# Altium project Acquisition_Board.PrjPcb
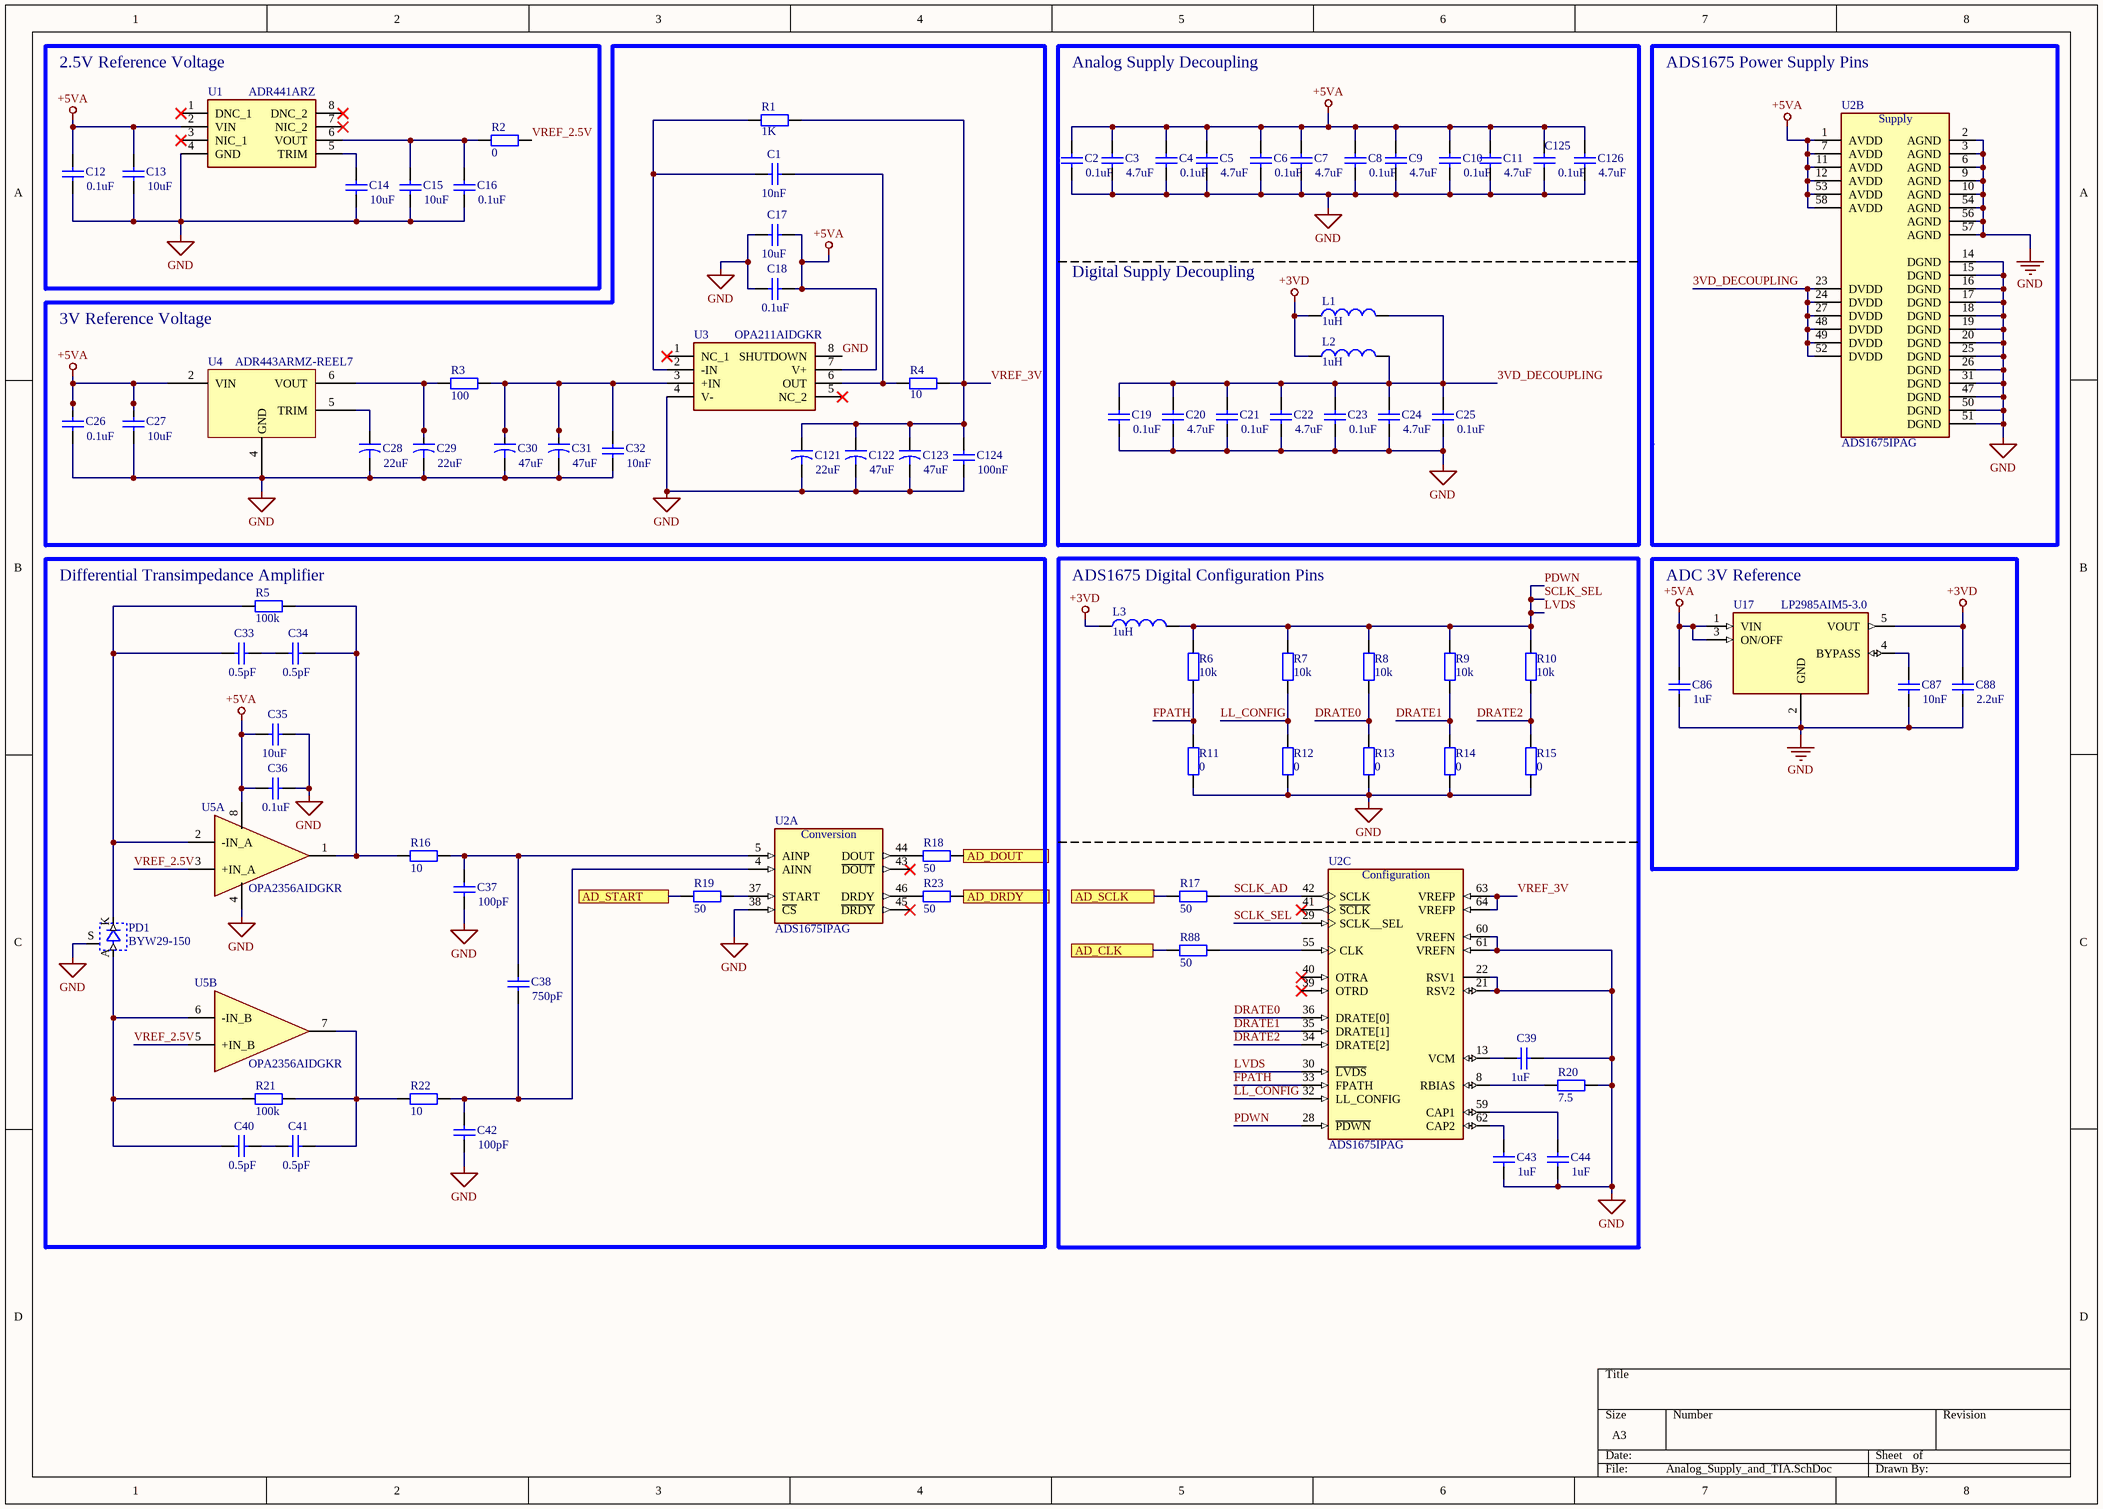
[diagram p0: Analog_Supply_and_TIA.SchDoc]
4 sheets, 272 parts. Net scope: flat (ports and power ports of the same name join across sheets).
Board file: Acquisition_Board_PCB.PcbDoc
Sheets:
  Analog_Supply_and_TIA.SchDoc
  Analog_Modulation.SchDoc
  Digital_Connectors_and_IHM.SchDoc
  Digital_STMG474RE.SchDoc

## Sheet Analog_Supply_and_TIA.SchDoc
size A3; SheetNumber: 1; SheetTotal: 4

### Parts
C1  value 10nF  [CC_0805]  (hidden comment: Cap)
C2  value 0.1uF  [CC_0805]  (hidden comment: Cap)
C3  value 4.7uF  [CC_0805]  (hidden comment: Cap)
C4  value 0.1uF  [CC_0805]  (hidden comment: Cap)
C5  value 4.7uF  [CC_0805]  (hidden comment: Cap)
C6  value 0.1uF  [CC_0805]  (hidden comment: Cap)
C7  value 4.7uF  [CC_0805]  (hidden comment: Cap)
C8  value 0.1uF  [CC_0805]  (hidden comment: Cap)
C9  value 4.7uF  [CC_0805]  (hidden comment: Cap)
C10  value 0.1uF  [CC_0805]  (hidden comment: Cap)
C11  value 4.7uF  [CC_0805]  (hidden comment: Cap)
C12  value 0.1uF  [CC_0805]  (hidden comment: Cap)
C13  value 10uF  [CC_0805]  (hidden comment: Cap)
C14  value 10uF  [CC_0805]  (hidden comment: Cap)
C15  value 10uF  [CC_0805]  (hidden comment: Cap)
C16  value 0.1uF  [CC_0805]  (hidden comment: Cap)
C17  value 10uF  [CC_0805]  (hidden comment: Cap)
C18  value 0.1uF  [CC_0805]  (hidden comment: Cap)
C19  value 0.1uF  [CC_0805]  (hidden comment: Cap)
C20  value 4.7uF  [CC_0805]  (hidden comment: Cap)
C21  value 0.1uF  [CC_0805]  (hidden comment: Cap)
C22  value 4.7uF  [CC_0805]  (hidden comment: Cap)
C23  value 0.1uF  [CC_0805]  (hidden comment: Cap)
C24  value 4.7uF  [CC_0805]  (hidden comment: Cap)
C25  value 0.1uF  [CC_0805]  (hidden comment: Cap)
C26  value 0.1uF  [CC_0805]  (hidden comment: Cap)
C27  value 10uF  [CC_0805]  (hidden comment: Cap)
C28  value 22uF  [CC_0805]  (hidden comment: Cap2)
C29  value 22uF  [CC_0805]  (hidden comment: Cap2)
C30  value 47uF  [CC_0805]  (hidden comment: Cap2)
C31  value 47uF  [CC_0805]  (hidden comment: Cap2)
C32  value 10nF  [CC_0805]  (hidden comment: Cap)
C33  value 0.5pF  [CC_0805]  (hidden comment: Cap)
C34  value 0.5pF  [CC_0805]  (hidden comment: Cap)
C35  value 10uF  [CC_0805]  (hidden comment: Cap)
C36  value 0.1uF  [CC_0805]  (hidden comment: Cap)
C37  value 100pF  [CC_0805]  (hidden comment: Cap)
C38  value 750pF  [CC_0805]  (hidden comment: Cap)
C39  value 1uF  [CC_0805]  (hidden comment: Cap)
C40  value 0.5pF  [CC_0805]  (hidden comment: Cap)
C41  value 0.5pF  [CC_0805]  (hidden comment: Cap)
C42  value 100pF  [CC_0805]  (hidden comment: Cap)
C43  value 1uF  [CC_0805]  (hidden comment: Cap)
C44  value 1uF  [CC_0805]  (hidden comment: Cap)
C86  value 1uF  [CC_0805]  (hidden comment: Cap)
C87  value 10nF  [CC_0805]  (hidden comment: Cap)
C88  value 2.2uF  [CC_0805]  (hidden comment: Cap)
C121  value 22uF  [CC_0805]  (hidden comment: Cap2)
C122  value 47uF  [CC_0805]  (hidden comment: Cap2)
C123  value 47uF  [CC_0805]  (hidden comment: Cap2)
C124  value 100nF  [CC_0805]  (hidden comment: Cap)
C125  value 0.1uF  [CC_0805]  (hidden comment: Cap)
C126  value 4.7uF  [CC_0805]  (hidden comment: Cap)
L1  value 1uH  [WE-PMI_0805_H0.5]  (hidden comment: Inductor)
L2  value 1uH  [WE-PMI_0805_H0.5]  (hidden comment: Inductor)
L3  value 1uH  [WE-PMI_0805_H0.5]  (hidden comment: Inductor)
PD1  BYW29-150  [BYW29-150]
R1  value 1K  [RR_1220]  (hidden comment: Res2)
R2  value 0  [RR_1220]  (hidden comment: Res2)
R3  value 100  [RR_1220]  (hidden comment: Res2)
R4  value 10  [RR_1220]  (hidden comment: Res2)
R5  value 100k  [RR_1220]  (hidden comment: Res2)
R6  value 10k  [RR_1220]  (hidden comment: Res2)
R7  value 10k  [RR_1220]  (hidden comment: Res2)
R8  value 10k  [RR_1220]  (hidden comment: Res2)
R9  value 10k  [RR_1220]  (hidden comment: Res2)
R10  value 10k  [RR_1220]  (hidden comment: Res2)
R11  value 0  [RR_1220]  (hidden comment: Res2)
R12  value 0  [RR_1220]  (hidden comment: Res2)
R13  value 0  [RR_1220]  (hidden comment: Res2)
R14  value 0  [RR_1220]  (hidden comment: Res2)
R15  value 0  [RR_1220]  (hidden comment: Res2)
R16  value 10  [RR_1220]  (hidden comment: Res2)
R17  value 50  [RR_1220]  (hidden comment: Res2)
R18  value 50  [RR_1220]  (hidden comment: Res2)
R19  value 50  [RR_1220]  (hidden comment: Res2)
R20  value 7.5  [RR_1220]  (hidden comment: Res2)
R21  value 100k  [RR_1220]  (hidden comment: Res2)
R22  value 10  [RR_1220]  (hidden comment: Res2)
R23  value 50  [RR_1220]  (hidden comment: Res2)
R88  value 50  [RR_1220]  (hidden comment: Res2)
U1  ADR441ARZ  [ADR441ARZ]
U2  ADS1675IPAG  [ADS1675IPAG]  (parts A,B,C of 3)
U3  OPA211AIDGKR  [OPA211AIDGKR]
U4  ADR443ARMZ-REEL7  [ADR443ARMZ-REEL7 - duplicate]
U5  OPA2356AIDGKR  [OPA2356AIDGKR]  (parts A,B of 2)
U17  LP2985AIM5-3.0  [LP2985AIM5-3.0]

### Blocks framed on the sheet
2.5V Reference Voltage: C12-C16 R2 U1
3V Reference Voltage: C1 C17 C18 C26-C32 C121-C124 R1 R3 R4 U3 U4
ADS1675 Power Supply Pins: U2
Differential Transimpedance Amplifier: C33-C38 C40-C42 PD1 R5 R16 R18 R19 R21-R23 U2 U5
ADS1675 Digital Configuration Pins: C39 C43 C44 L3 R6-R15 R17 R20 R88 U2
ADC 3V Reference: C86-C88 U17

### Ports
AD_CLK (see Digital_Connectors_and_IHM[2A], Digital_Connectors_and_IHM[5A], Digital_STMG474RE[3B]), AD_DOUT (see Digital_Connectors_and_IHM[1A], Digital_STMG474RE[3B]), AD_DRDY (see Digital_Connectors_and_IHM[1A], Digital_STMG474RE[3B]), AD_SCLK (see Digital_Connectors_and_IHM[1A], Digital_STMG474RE[5B]), AD_START (see Digital_Connectors_and_IHM[1A], Digital_STMG474RE[3B])

### Nets
+3VD: C88.1 L1.1 L2.1 L3.1 U17.5(VOUT)
+5VA: C2.2 C3.2 C4.2 C5.2 C6.2 C7.2 C8.2 C9.2 C10.2 C11.2 C12.2 C13.2 C17.1 C18.1 C26.2 C27.2 C35.2 C36.2 C86.1 C125.2 C126.2 U1.2(VIN) U2.1(AVDD) U2.7(AVDD) U2.11(AVDD) U2.12(AVDD) U2.53(AVDD) U2.58(AVDD) U3.7(V+) U4.2(VIN) U5.8(V+) U17.1(VIN) U17.3(ON/OFF)
GND: C2.1 C3.1 C4.1 C5.1 C6.1 C7.1 C8.1 C9.1 C10.1 C11.1 C12.1 C13.1 C14.1 C15.1 C16.1 C17.2 C18.2 C19.1 C20.1 C21.1 C22.1 C23.1 C24.1 C25.1 C26.1 C27.1 C28.2 C29.2 C30.2 C31.2 C32.1 C35.1 C36.1 C37.1 C39.1 C42.1 C43.2 C44.2 C86.2 C87.2 C88.2 C121.2 C122.2 C123.2 C124.1 C125.1 C126.1 PD1.S R11.1 R12.1 R13.1 R14.1 R15.1 R20.2 U1.4(GND) U2.2(AGND) U2.3(AGND) U2.6(AGND) U2.9(AGND) U2.10(AGND) U2.14(DGND) U2.15(DGND) U2.16(DGND) U2.17(DGND) U2.18(DGND) U2.19(DGND) U2.20(DGND) U2.21(RSV2) U2.22(RSV1) U2.25(DGND) U2.26(DGND) U2.31(DGND) U2.38(~{CS}) U2.47(DGND) U2.50(DGND) U2.51(DGND) U2.54(AGND) U2.56(AGND) U2.57(AGND) U2.60(VREFN) U2.61(VREFN) U3.4(V-) U3.8(SHUTDOWN) U4.4(GND) U5.4(V-) U17.2(GND)
3VD_DECOUPLING: C19.2 C20.2 C21.2 C22.2 C23.2 C24.2 C25.2 L1.2 L2.2 U2.23(DVDD) U2.24(DVDD) U2.27(DVDD) U2.48(DVDD) U2.49(DVDD) U2.52(DVDD)
DRATE0: R8.1 R13.2 U2.36(DRATE[0])
DRATE1: R9.1 R14.2 U2.35(DRATE[1])
DRATE2: R10.1 R15.2 U2.34(DRATE[2])
FPATH: R6.1 R11.2 U2.33(FPATH)
LL_CONFIG: R7.1 R12.2 U2.32(LL_CONFIG)
LVDS: L3.2 R6.2 R7.2 R8.2 R9.2 R10.2 U2.28(~{PDWN}) U2.29(SCLK__SEL) U2.30(~{LVDS})  [also labelled PDWN, SCLK_SEL]
SCLK_AD: R17.2 U2.42(SCLK)
VREF_2.5V: R2.2 U5.3(+IN_A) U5.5(+IN_B)
VREF_3V: C121.1 C122.1 C123.1 C124.2 R1.1 R4.1 U2.63(VREFP) U2.64(VREFP)
NetC1_1: C1.1 R4.2 U3.6(OUT)
NetC1_2: C1.2 R1.2 U3.2(-IN)
NetC14_2: C14.2 U1.5(TRIM)
NetC15_2: C15.2 C16.2 R2.1 U1.6(VOUT)
NetC28_1: C28.1 U4.5(TRIM)
NetC29_1: C29.1 R3.1 U4.6(VOUT)
NetC30_1: C30.1 C31.1 C32.2 R3.2 U3.3(+IN)
NetC33_1: C33.1 C34.2
NetC33_2: C33.2 PD1.K R5.1 U5.2(-IN_A)
NetC34_1: C34.1 R5.2 R16.1 U5.1(OUT_A)
NetC37_2: C37.2 C38.2 R16.2 U2.5(AINP)
NetC38_1: C38.1 C42.2 R22.2 U2.4(AINN)
NetC39_2: C39.2 U2.13(VCM)
NetC40_1: C40.1 C41.2
NetC40_2: C40.2 PD1.A R21.1 U5.6(-IN_B)
NetC41_1: C41.1 R21.2 R22.1 U5.7(OUT_B)
NetC43_1: C43.1 U2.62(CAP2)
NetC44_1: C44.1 U2.59(CAP1)
NetC87_1: C87.1 U17.4(BYPASS)
NetR17_1: R17.1 ; port AD_SCLK
NetR18_1: R18.1 U2.44(DOUT)
NetR18_2: R18.2 ; port AD_DOUT
NetR19_1: R19.1 ; port AD_START
NetR19_2: R19.2 U2.37(START)
NetR20_1: R20.1 U2.8(RBIAS)
NetR23_1: R23.1 U2.46(DRDY)
NetR23_2: R23.2 ; port AD_DRDY
NetR56_2: R88.1 ; port AD_CLK
NetR88_2: R88.2 U2.55(CLK)

Not connected (* = marked no-connect by the designer): U1 1(DNC_1)* 3(NIC_1)* 7(NIC_2)* 8(DNC_2)*; U2 39(OTRD)* 40(OTRA)* 41(~{S}~{C}~{L}~{K})* 43(~{DOUT})* 45(~{DRDY})*; U3 1(NC_1)* 5(NC_2)*

### Notes on the sheet
- Analog Supply Decoupling
- (near L1) Digital Supply Decoupling
- (in symbol ADS1675IPAG, part A) Conversion
- (in symbol ADS1675IPAG, part B) Supply
- (in symbol ADS1675IPAG, part C) Configuration

### Library data of the parts
C1-C27 C32-C44 C86-C88 C124-C126 = Cap: Capacitor; Published: 8-Jun-2000; LatestRevisionDate: 17-Jul-2002; LatestRevisionNote: Re-released for DXP Platform.; PackageReference: RAD-0.3; Publisher: Altium Limited; PackageDescription: Radial Cap, Thru-Hole; 2 Leads; 0.3 in Pin Spacing
C28-C31 C121-C123 = Cap2: Capacitor; Published: 23-Sep-2002; PackageReference: CAPR5-4X5; Publisher: Altium Limited; PackageDescription: Capacitor; 2 Leads
L1-L3 = Inductor: Code_IEC: 1005; Published: 8-Jun-2000; LatestRevisionDate: 29-May-2009; LatestRevisionNote: IPC-7351 Footprint Added.; PackageReference: 0402-A; Publisher: Altium Limited; PackageDescription: Chip Inductor; Code_JEITA: 0402
PD1 = BYW29-150: Text Field1: 10; Text Field2: 20
R1-R23 R88 = Res2: Resistor; Published: 8-Jun-2000; LatestRevisionDate: 17-Jul-2002; LatestRevisionNote: Re-released for DXP Platform.; PackageReference: AXIAL-0.4; Publisher: Altium Limited; PackageDescription: Axial Device, Thru-Hole; 2 Leads; 0.4 in Pin Spacing
U1 = ADR441ARZ: Series Voltage Reference IC Fixed 2.5V V +/-0.12% 10 mA 8-SOIC; Manufacturer_Name: Analog Devices; Geometry.Height: 1.75mm; Manufacturer_Part_Number: ADR441ARZ; Mouser Part Number: 584-ADR441ARZ; Mouser Price/Stock: https://www.mouser.co.uk/ProductDetail/Analog-Devices/ADR441ARZ?qs=WIvQP4zGanjF%252B9HT%2FrItQQ%3D%3D; Arrow Part Number: ADR441ARZ; Arrow Price/Stock: https://www.arrow.com/en/products/adr441arz/analog-devices?region=europe; Datasheet Link: https://www.analog.com/media/en/technical-documentation/data-sheets/adr440_441_443_444_445.pdf
U2 = ADS1675IPAG: 4MSPS, 24-Bit Analog-to-Digital Converter; MF: Texas Instruments; SnapEDA_Link: https://www.snapeda.com/parts/ADS1675IPAG/Texas+Instruments/view-part/?ref=snap; Package: TQFP-64 Texas Instruments; MP: ADS1675IPAG; Check_prices: https://www.snapeda.com/parts/ADS1675IPAG/Texas+Instruments/view-part/?ref=eda; Purchase-URL: https://pricing.snapeda.com/search/part/ADS1675IPAG/?ref=eda; Price: None; Value: *; Availability: In Stock
U3 = OPA211AIDGKR: Precision Amplifiers 1.1nV/rtHz Noise Lo Pwr Prec Op Amp; Manufacturer_Name: Texas Instruments; Geometry.Height: 1.1mm; Manufacturer_Part_Number: OPA211AIDGKR; Mouser Part Number: 595-OPA211AIDGKR; Mouser Price/Stock: https://www.mouser.co.uk/ProductDetail/Texas-Instruments/OPA211AIDGKR?qs=iSMark9AYDXgBzgxm95hVg%3D%3D; Arrow Part Number: OPA211AIDGKR; Arrow Price/Stock: https://www.arrow.com/en/products/opa211aidgkr/texas-instruments?utm_currency=USD&region=nac; Datasheet Link: https://www.ti.com/general/docs/suppproductinfo.tsp?distId=10&gotoUrl=https%3A%2F%2Fwww.ti.com%2Flit%2Fgpn%2Fopa211
U4 = ADR443ARMZ-REEL7: Ultralow Noise, LDO XFET Voltage Reference with Current Sink and Source, 3 V Output, 3.5 to 18 V Supply, Industrial, 8-pin SOP (RM-8), Reel
U5 = OPA2356AIDGKR: High Speed Operational Amplifiers 2.5V 200MHz GBW CMOS Dual Op Amp; Manufacturer_Name: Texas Instruments; Geometry.Height: 1.1mm; Manufacturer_Part_Number: OPA2356AIDGKR; Mouser Part Number: 595-OPA2356AIDGKR; Mouser Price/Stock: https://www.mouser.co.uk/ProductDetail/Texas-Instruments/OPA2356AIDGKR?qs=7nS3%252BbEUL6thmoW05USD8Q%3D%3D; Arrow Part Number: OPA2356AIDGKR; Arrow Price/Stock: https://www.arrow.com/en/products/opa2356aidgkr/texas-instruments?region=nac; Datasheet Link: http://www.ti.com/lit/ds/symlink/opa2356.pdf
U17 = LP2985AIM5-3.0: 150-mA, 16-V, low-dropout voltage regulator with enable; MF: Texas Instruments; MP: LP2985AIM5-3.0/NOPB; SnapEDA_Link: https://www.snapeda.com/parts/LP2985AIM5-3.0/NOPB/Texas+Instruments/view-part/?ref=snap; Package: SOT-23-5 Texas Instruments; Value: *; Check_prices: https://www.snapeda.com/parts/LP2985AIM5-3.0/NOPB/Texas+Instruments/view-part/?ref=eda

## Sheet Analog_Modulation.SchDoc
size A3; SheetNumber: 2; SheetTotal: 4
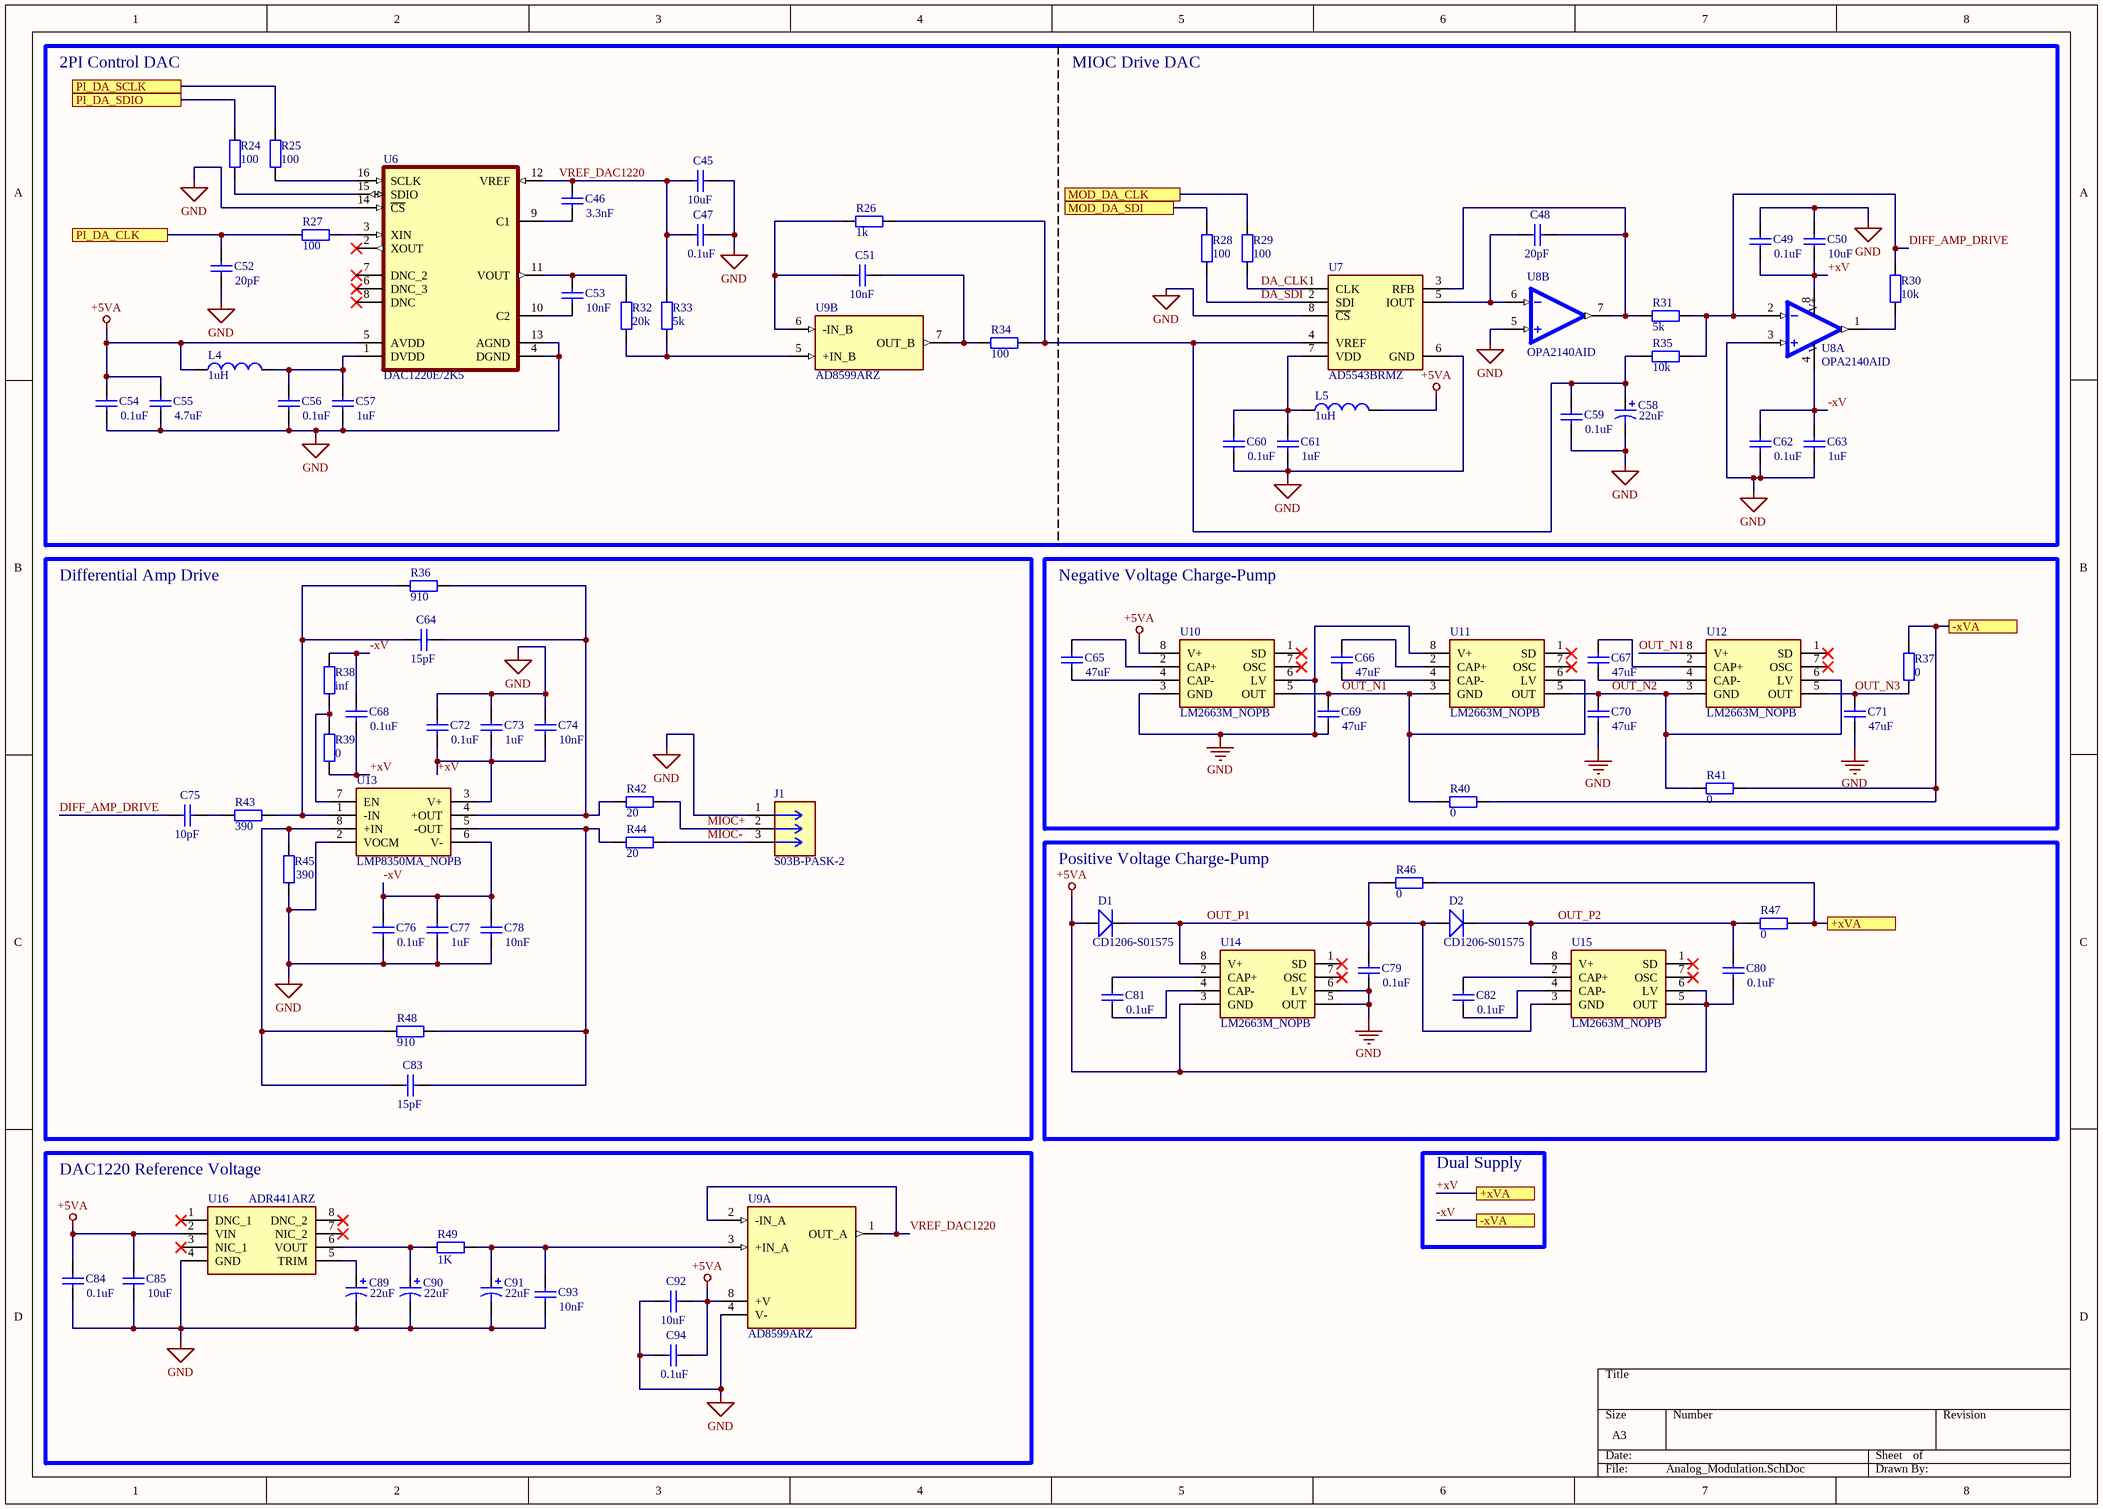
[diagram p1: Analog_Modulation.SchDoc]

### Parts
C45  value 10uF  [CC_0805]  (hidden comment: Cap)
C46  value 3.3nF  [CC_0805]  (hidden comment: Cap)
C47  value 0.1uF  [CC_0805]  (hidden comment: Cap)
C48  value 20pF  [CC_0805]  (hidden comment: Cap)
C49  value 0.1uF  [CC_0805]  (hidden comment: Cap)
C50  value 10uF  [CC_0805]  (hidden comment: Cap)
C51  value 10nF  [CC_0805]  (hidden comment: Cap)
C52  value 20pF  [CC_0805]  (hidden comment: Cap)
C53  value 10nF  [CC_0805]  (hidden comment: Cap)
C54  value 0.1uF  [CC_0805]  (hidden comment: Cap)
C55  value 4.7uF  [CC_0805]  (hidden comment: Cap)
C56  value 0.1uF  [CC_0805]  (hidden comment: Cap)
C57  value 1uF  [CC_0805]  (hidden comment: Cap)
C58  value 22uF  [CC_0805]  (hidden comment: Cap Pol1)
C59  value 0.1uF  [CC_0805]  (hidden comment: Cap)
C60  value 0.1uF  [CC_0805]  (hidden comment: Cap)
C61  value 1uF  [CC_0805]  (hidden comment: Cap)
C62  value 0.1uF  [CC_0805]  (hidden comment: Cap)
C63  value 1uF  [CC_0805]  (hidden comment: Cap)
C64  value 15pF  [CC_0805]  (hidden comment: Cap)
C65  value 47uF  [CC_0805]  (hidden comment: Cap)
C66  value 47uF  [CC_0805]  (hidden comment: Cap)
C67  value 47uF  [CC_0805]  (hidden comment: Cap)
C68  value 0.1uF  [CC_0805]  (hidden comment: Cap)
C69  value 47uF  [CC_0805]  (hidden comment: Cap)
C70  value 47uF  [CC_0805]  (hidden comment: Cap)
C71  value 47uF  [CC_0805]  (hidden comment: Cap)
C72  value 0.1uF  [CC_0805]  (hidden comment: Cap)
C73  value 1uF  [CC_0805]  (hidden comment: Cap)
C74  value 10nF  [CC_0805]  (hidden comment: Cap)
C75  value 10pF  [CC_0805]  (hidden comment: Cap)
C76  value 0.1uF  [CC_0805]  (hidden comment: Cap)
C77  value 1uF  [CC_0805]  (hidden comment: Cap)
C78  value 10nF  [CC_0805]  (hidden comment: Cap)
C79  value 0.1uF  [CC_0805]  (hidden comment: Cap)
C80  value 0.1uF  [CC_0805]  (hidden comment: Cap)
C81  value 0.1uF  [CC_0805]  (hidden comment: Cap)
C82  value 0.1uF  [CC_0805]  (hidden comment: Cap)
C83  value 15pF  [CC_0805]  (hidden comment: Cap)
C84  value 0.1uF  [CC_0805]  (hidden comment: Cap)
C85  value 10uF  [CC_0805]  (hidden comment: Cap)
C89  value 22uF  [CC_0805]  (hidden comment: Cap Pol1)
C90  value 22uF  [CC_0805]  (hidden comment: Cap Pol1)
C91  value 22uF  [CC_0805]  (hidden comment: Cap Pol1)
C92  value 10uF  [CC_0805]  (hidden comment: Cap)
C93  value 10nF  [CC_0805]  (hidden comment: Cap)
C94  value 0.1uF  [CC_0805]  (hidden comment: Cap)
D1  CD1206-S01575  [LED-1206]
D2  CD1206-S01575  [LED-1206]
J1  S03B-PASK-2  [S03B-PASK-2]
L4  value 1uH  [WE-PMI_0805_H0.5]  (hidden comment: Inductor)
L5  value 1uH  [WE-PMI_0805_H0.5]  (hidden comment: Inductor)
R24  value 100  [RR_1220]  (hidden comment: Res2)
R25  value 100  [RR_1220]  (hidden comment: Res2)
R26  value 1k  [RR_1220]  (hidden comment: Res2)
R27  value 100  [RR_1220]  (hidden comment: Res2)
R28  value 100  [RR_1220]  (hidden comment: Res2)
R29  value 100  [RR_1220]  (hidden comment: Res2)
R30  value 10k  [RR_1220]  (hidden comment: Res2)
R31  value 5k  [RR_1220]  (hidden comment: Res2)
R32  value 20k  [RR_1220]  (hidden comment: Res2)
R33  value 5k  [RR_1220]  (hidden comment: Res2)
R34  value 100  [RR_1220]  (hidden comment: Res2)
R35  value 10k  [RR_1220]  (hidden comment: Res2)
R36  value 910  [RR_1220]  (hidden comment: Res2)
R37  value 0  [RR_1220]  (hidden comment: Res2)
R38  value inf  [RR_1220]  (hidden comment: Res2)
R39  value 0  [RR_1220]  (hidden comment: Res2)
R40  value 0  [RR_1220]  (hidden comment: Res2)
R41  value 0  [RR_1220]  (hidden comment: Res2)
R42  value 20  [RR_1220]  (hidden comment: Res2)
R43  value 390  [RR_1220]  (hidden comment: Res2)
R44  value 20  [RR_1220]  (hidden comment: Res2)
R45  value 390  [RR_1220]  (hidden comment: Res2)
R46  value 0  [RR_1220]  (hidden comment: Res2)
R47  value 0  [RR_1220]  (hidden comment: Res2)
R48  value 910  [RR_1220]  (hidden comment: Res2)
R49  value 1K  [RR_1220]  (hidden comment: Res2)
U6  DAC1220E/2K5  [DAC1220E/2K5]
U7  AD5543BRMZ  [AD5543BRMZ]
U8  OPA2140AID  [OPA2140AID]  (parts A,B of 2)
U9  AD8599ARZ  [AD8599ARZ]  (parts A,B of 2)
U10  LM2663M_NOPB  [LM2663M_NOPB]
U11  LM2663M_NOPB  [LM2663M_NOPB]
U12  LM2663M_NOPB  [LM2663M_NOPB]
U13  LMP8350MA_NOPB  [LMP8350MA_NOPB]
U14  LM2663M_NOPB  [LM2663M_NOPB]
U15  LM2663M_NOPB  [LM2663M_NOPB]
U16  ADR441ARZ  [SOIC127P600X175-8N]

### Blocks framed on the sheet
Differential Amp Drive: C64 C68 C72-C78 C83 J1 R36 R38 R39 R42-R45 R48 U13
Negative Voltage Charge-Pump: C65-C67 C69-C71 R37 R40 R41 U10-U12
Positive Voltage Charge-Pump: C79-C82 D1 D2 R46 R47 U14 U15
DAC1220 Reference Voltage: C84 C85 C89-C94 R49 U9 U16

### Ports
+xVA (see Analog_Modulation[6D]), +xVA (see Analog_Modulation[7C]), -xVA (see Analog_Modulation[6D]), -xVA (see Analog_Modulation[8B]), MOD_DA_CLK (see Digital_STMG474RE[3B]), MOD_DA_SDI (see Digital_STMG474RE[3B]), PI_DA_CLK (see Digital_STMG474RE[5B]), PI_DA_SCLK (see Digital_STMG474RE[5B]), PI_DA_SDIO (see Digital_STMG474RE[5B])

### Nets
+5VA: C54.1 C55.1 C80.2 C84.2 C85.2 C92.1 C94.1 D1.POS L4.1 L5.2 U6.5(AVDD) U9.8(+V) U10.8(V+) U14.3(GND) U15.5(OUT) U15.6(LV) U16.2(VIN)
GND: C45.1 C47.1 C49.1 C50.1 C52.2 C54.2 C55.2 C56.2 C57.2 C58.2 C59.1 C60.2 C61.2 C62.2 C63.2 C69.2 C70.2 C71.2 C72.1 C73.1 C74.1 C76.2 C77.2 C78.2 C79.2 C84.1 C85.1 C89.2 C90.2 C91.2 C92.2 C93.1 C94.2 J1.1 R45.2 U6.4(DGND) U6.13(AGND) U6.14(~{CS}) U7.6(GND) U7.8(~{CS}) U8.3(+INA) U8.5(+INB) U9.4(V-) U10.3(GND) U10.6(LV) U11.8(V+) U13.2(VOCM) U14.5(OUT) U14.6(LV) U16.4(GND)
+xV: C49.2 C50.2 C68.2 C72.2 C73.2 C74.2 R39.2 R46.1 R47.1 U8.8(V+) U13.3(V+) ; port +xVA
-xV: C62.1 C63.1 C68.1 C76.1 C77.1 C78.1 R37.1 R38.1 R40.1 R41.1 U8.4(V-) U13.6(V-) ; port -xVA
DA_CLK: R29.2 U7.1(CLK)
DA_SDI: R28.2 U7.2(SDI)
DIFF_AMP_DRIVE: C75.2 R30.1 R31.1 R35.1 U8.2(-INA)
MIOC+: J1.2 R42.1
MIOC-: J1.3 R44.1
OUT_N1: C69.1 R40.2 U10.5(OUT) U11.3(GND) U11.6(LV) U12.8(V+)
OUT_N2: C70.1 R41.2 U11.5(OUT) U12.3(GND) U12.6(LV)
OUT_N3: C71.1 R37.2 U12.5(OUT)
OUT_P1: C79.1 D1.NEG D2.POS R46.2 U14.8(V+) U15.3(GND)
OUT_P2: C80.1 D2.NEG R47.2 U15.8(V+)
VREF_DAC1220: C45.2 C46.1 C47.2 R33.2 U6.12(VREF) U9.1(OUT_A) U9.2(-IN_A)
NetC46_2: C46.2 U6.9(C1)
NetC48_1: C48.1 R31.2 U7.3(RFB) U8.7(OUTB)
NetC48_2: C48.2 U7.5(IOUT) U8.6(-INB)
NetC51_1: C51.1 R34.2 U9.7(OUT_B)
NetC51_2: C51.2 R26.2 U9.6(-IN_B)
NetC52_1: C52.1 R27.2 ; port PI_DA_CLK
NetC53_1: C53.1 R32.2 U6.11(VOUT)
NetC53_2: C53.2 U6.10(C2)
NetC56_1: C56.1 C57.1 L4.2 U6.1(DVDD)
NetC58_1: C58.1 C59.2 R26.1 R34.1 R35.2 U7.4(VREF)
NetC60_1: C60.1 C61.1 L5.1 U7.7(VDD)
NetC64_1: C64.1 R36.1 R42.2 U13.4(+OUT)
NetC64_2: C64.2 R36.2 R43.1 U13.1(-IN)
NetC65_1: C65.1 U10.2(CAP+)
NetC65_2: C65.2 U10.4(CAP-)
NetC66_1: C66.1 U11.2(CAP+)
NetC66_2: C66.2 U11.4(CAP-)
NetC67_1: C67.1 U12.2(CAP+)
NetC67_2: C67.2 U12.4(CAP-)
NetC75_1: C75.1 R43.2
NetC81_1: C81.1 U14.2(CAP+)
NetC81_2: C81.2 U14.4(CAP-)
NetC82_1: C82.1 U15.2(CAP+)
NetC82_2: C82.2 U15.4(CAP-)
NetC83_1: C83.1 R44.2 R48.1 U13.5(-OUT)
NetC83_2: C83.2 R45.1 R48.2 U13.8(+IN)
NetC89_1: C89.1 U16.5(TRIM)
NetC90_1: C90.1 R49.1 U16.6(VOUT)
NetC91_1: C91.1 C93.2 R49.2 U9.3(+IN_A)
NetR24_1: R24.1 U6.15(SDIO)
NetR24_2: R24.2 ; port PI_DA_SDIO
NetR25_1: R25.1 U6.16(SCLK)
NetR25_2: R25.2 ; port PI_DA_SCLK
NetR27_1: R27.1 U6.3(XIN)
NetR28_1: R28.1 ; port MOD_DA_SDI
NetR29_1: R29.1 ; port MOD_DA_CLK
NetR30_2: R30.2 U8.1(OUTA)
NetR32_1: R32.1 R33.1 U9.5(+IN_B)
NetR38_2: R38.2 R39.1 U13.7(EN)

Not connected (* = marked no-connect by the designer): U6 2(XOUT)* 6(DNC_3)* 7(DNC_2)* 8(DNC)*; U10 1(SD)* 7(OSC)*; U11 1(SD)* 7(OSC)*; U12 1(SD)* 7(OSC)*; U14 1(SD)* 7(OSC)*; U15 1(SD)* 7(OSC)*; U16 1(DNC_1)* 3(NIC_1)* 7(NIC_2)* 8(DNC_2)*

### Notes on the sheet
- 2PI Control DAC
- MIOC Drive DAC
- Dual Supply

### Library data of the parts
C45-C57 C59-C85 C92-C94 = Cap: Capacitor; Published: 8-Jun-2000; LatestRevisionDate: 17-Jul-2002; LatestRevisionNote: Re-released for DXP Platform.; PackageReference: RAD-0.3; Publisher: Altium Limited; PackageDescription: Radial Cap, Thru-Hole; 2 Leads; 0.3 in Pin Spacing
C58 C89-C91 = Cap Pol1: Polarized Capacitor (Radial); Published: 8-Jun-2000; LatestRevisionDate: 17-Jul-2002; LatestRevisionNote: Re-released for DXP Platform.; PackageReference: RB7.6-15; Publisher: Altium Limited; PackageDescription: Polarized Capacitor (Radial); 2 Leads
D1 D2 = CD1206-S01575: CD1206-S01575, SMT Switching Diode, Vr=75V 150mA, 4ns, 2-Pin 1206 | Bourns CD1206-S01575; SnapEDA_Link: https://www.snapeda.com/parts/CD1206-S01575/Bourns/view-part/?ref=snap; Package: 1206 Bourns; Value: *; MF: Bourns; MP: CD1206-S01575; Check_prices: https://www.snapeda.com/parts/CD1206-S01575/Bourns/view-part/?ref=eda
J1 = S03B-PASK-2: Headers R/A PCB HDR 3P TIN FRICTION LOCK | Molex Incorporated 22-05-3031; SnapEDA_Link: https://www.snapeda.com/parts/22-05-3031/Molex/view-part/?ref=snap; Package: None; Value: *; MF: Molex; MP: 22-05-3031; Check_prices: https://www.snapeda.com/parts/22-05-3031/Molex/view-part/?ref=eda
L4 L5 = Inductor: Code_IEC: 1005; Published: 8-Jun-2000; LatestRevisionDate: 29-May-2009; LatestRevisionNote: IPC-7351 Footprint Added.; PackageReference: 0402-A; Publisher: Altium Limited; PackageDescription: Chip Inductor; Code_JEITA: 0402
R24-R49 = Res2: Resistor; Published: 8-Jun-2000; LatestRevisionDate: 17-Jul-2002; LatestRevisionNote: Re-released for DXP Platform.; PackageReference: AXIAL-0.4; Publisher: Altium Limited; PackageDescription: Axial Device, Thru-Hole; 2 Leads; 0.4 in Pin Spacing
U6 = DAC1220E/2K5: Digital-to-Analog Converter; Package: None; Price: None; Value: *; MP: DAC1220E/2K5; Availability: Unavailable
U7 = AD5543BRMZ: AD5543BRMZ, 16-Bit General Purpose DAC 2.47Msps, SPI, 8-Pin MSOP; Manufacturer_Name: Analog Devices; Geometry.Height: 1.1mm; Manufacturer_Part_Number: AD5543BRMZ; Mouser Part Number: 584-AD5543BRMZ; Mouser Price/Stock: https://www.mouser.co.uk/ProductDetail/Analog-Devices/AD5543BRMZ?qs=NmRFExCfTkGF7F9gS5LwsA%3D%3D; Arrow Part Number: AD5543BRMZ; Arrow Price/Stock: https://www.arrow.com/en/products/ad5543brmz/analog-devices?utm_currency=USD&region=nac; Datasheet Link: http://www.analog.com/static/imported-files/data_sheets/AD5543_5553.pdf
U8 = OPA2140AID: Dual-channel, 11-MHz, low-noise 36-V JFET precision operational amplifier with rail-to-rail output; MF: Texas Instruments; SnapEDA_Link: https://www.snapeda.com/parts/OPA2140AID/Texas+Instruments/view-part/?ref=snap; Package: SOIC-8 Texas Instruments; Value: *; MP: OPA2140AID; Check_prices: https://www.snapeda.com/parts/OPA2140AID/Texas+Instruments/view-part/?ref=eda
U9 = AD8599ARZ: Ultralow Distortion, Ultralow Noise Op Amp (Dual); MF: Analog Devices; Package: SOIC-8 Analog Devices; Price: None; Check_prices: https://www.snapeda.com/parts/AD8599ARZ/Analog+Devices/view-part/?ref=eda; Value: *; SnapEDA_Link: https://www.snapeda.com/parts/AD8599ARZ/Analog+Devices/view-part/?ref=snap; MP: AD8599ARZ; Availability: In Stock; Purchase-URL: https://pricing.snapeda.com/search?q=AD8599ARZ&ref=eda
U10-U12 U14 U15 = LM2663M_NOPB: 200mA switched capacitor voltage converter with low current shutdown mode; Manufacturer_Name: Texas Instruments; Manufacturer_Part_Number: LM2663M/NOPB; Geometry.Height: 1.75mm; Mouser Part Number: 926-LM2663M/NOPB; Mouser Price/Stock: https://www.mouser.co.uk/ProductDetail/Texas-Instruments/LM2663M-NOPB?qs=X1J7HmVL2ZH655akkcil2g%3D%3D; Arrow Part Number: LM2663M/NOPB; Arrow Price/Stock: https://www.arrow.com/en/products/lm2663mnopb/texas-instruments?utm_currency=USD&region=europe; Datasheet Link: http://www.ti.com/lit/ds/symlink/lm2663.pdf
U13 = LMP8350MA_NOPB: Ultra Low Distortion Fully Differential Precision ADC Driver with Selectable Power Modes; Manufacturer_Name: Texas Instruments; Manufacturer_Part_Number: LMP8350MA/NOPB; Geometry.Height: 1.75mm; Mouser Part Number: 926-LMP8350MA/NOPB; Mouser Price/Stock: https://www.mouser.co.uk/ProductDetail/Texas-Instruments/LMP8350MA-NOPB?qs=OYMYEaN9QmBOQoVkyNgTKw%3D%3D; Arrow Part Number: LMP8350MA/NOPB; Arrow Price/Stock: null?region=nac; Datasheet Link: http://www.ti.com/lit/gpn/lmp8350
U16 = ADR441ARZ: as U1 on sheet Analog_Supply_and_TIA; Manufacturer_Part_Number: ADR441ARZ; Mouser Part Number: 584-ADR441ARZ; Mouser Price/Stock: https://www.mouser.co.uk/ProductDetail/Analog-Devices/ADR441ARZ?qs=WIvQP4zGanjF%252B9HT%2FrItQQ%3D%3D; Arrow Part Number: ADR441ARZ; Arrow Price/Stock: https://www.arrow.com/en/products/adr441arz/analog-devices?region=europe; Datasheet Link: https://www.analog.com/media/en/technical-documentation/data-sheets/adr440_441_443_444_445.pdf

## Sheet Digital_Connectors_and_IHM.SchDoc
size A3; SheetNumber: 3; SheetTotal: 4; SPICEModelCachePRCXJTIU: <root> / <DocumentId>PRCXJTIU</DocumentId> / </root>
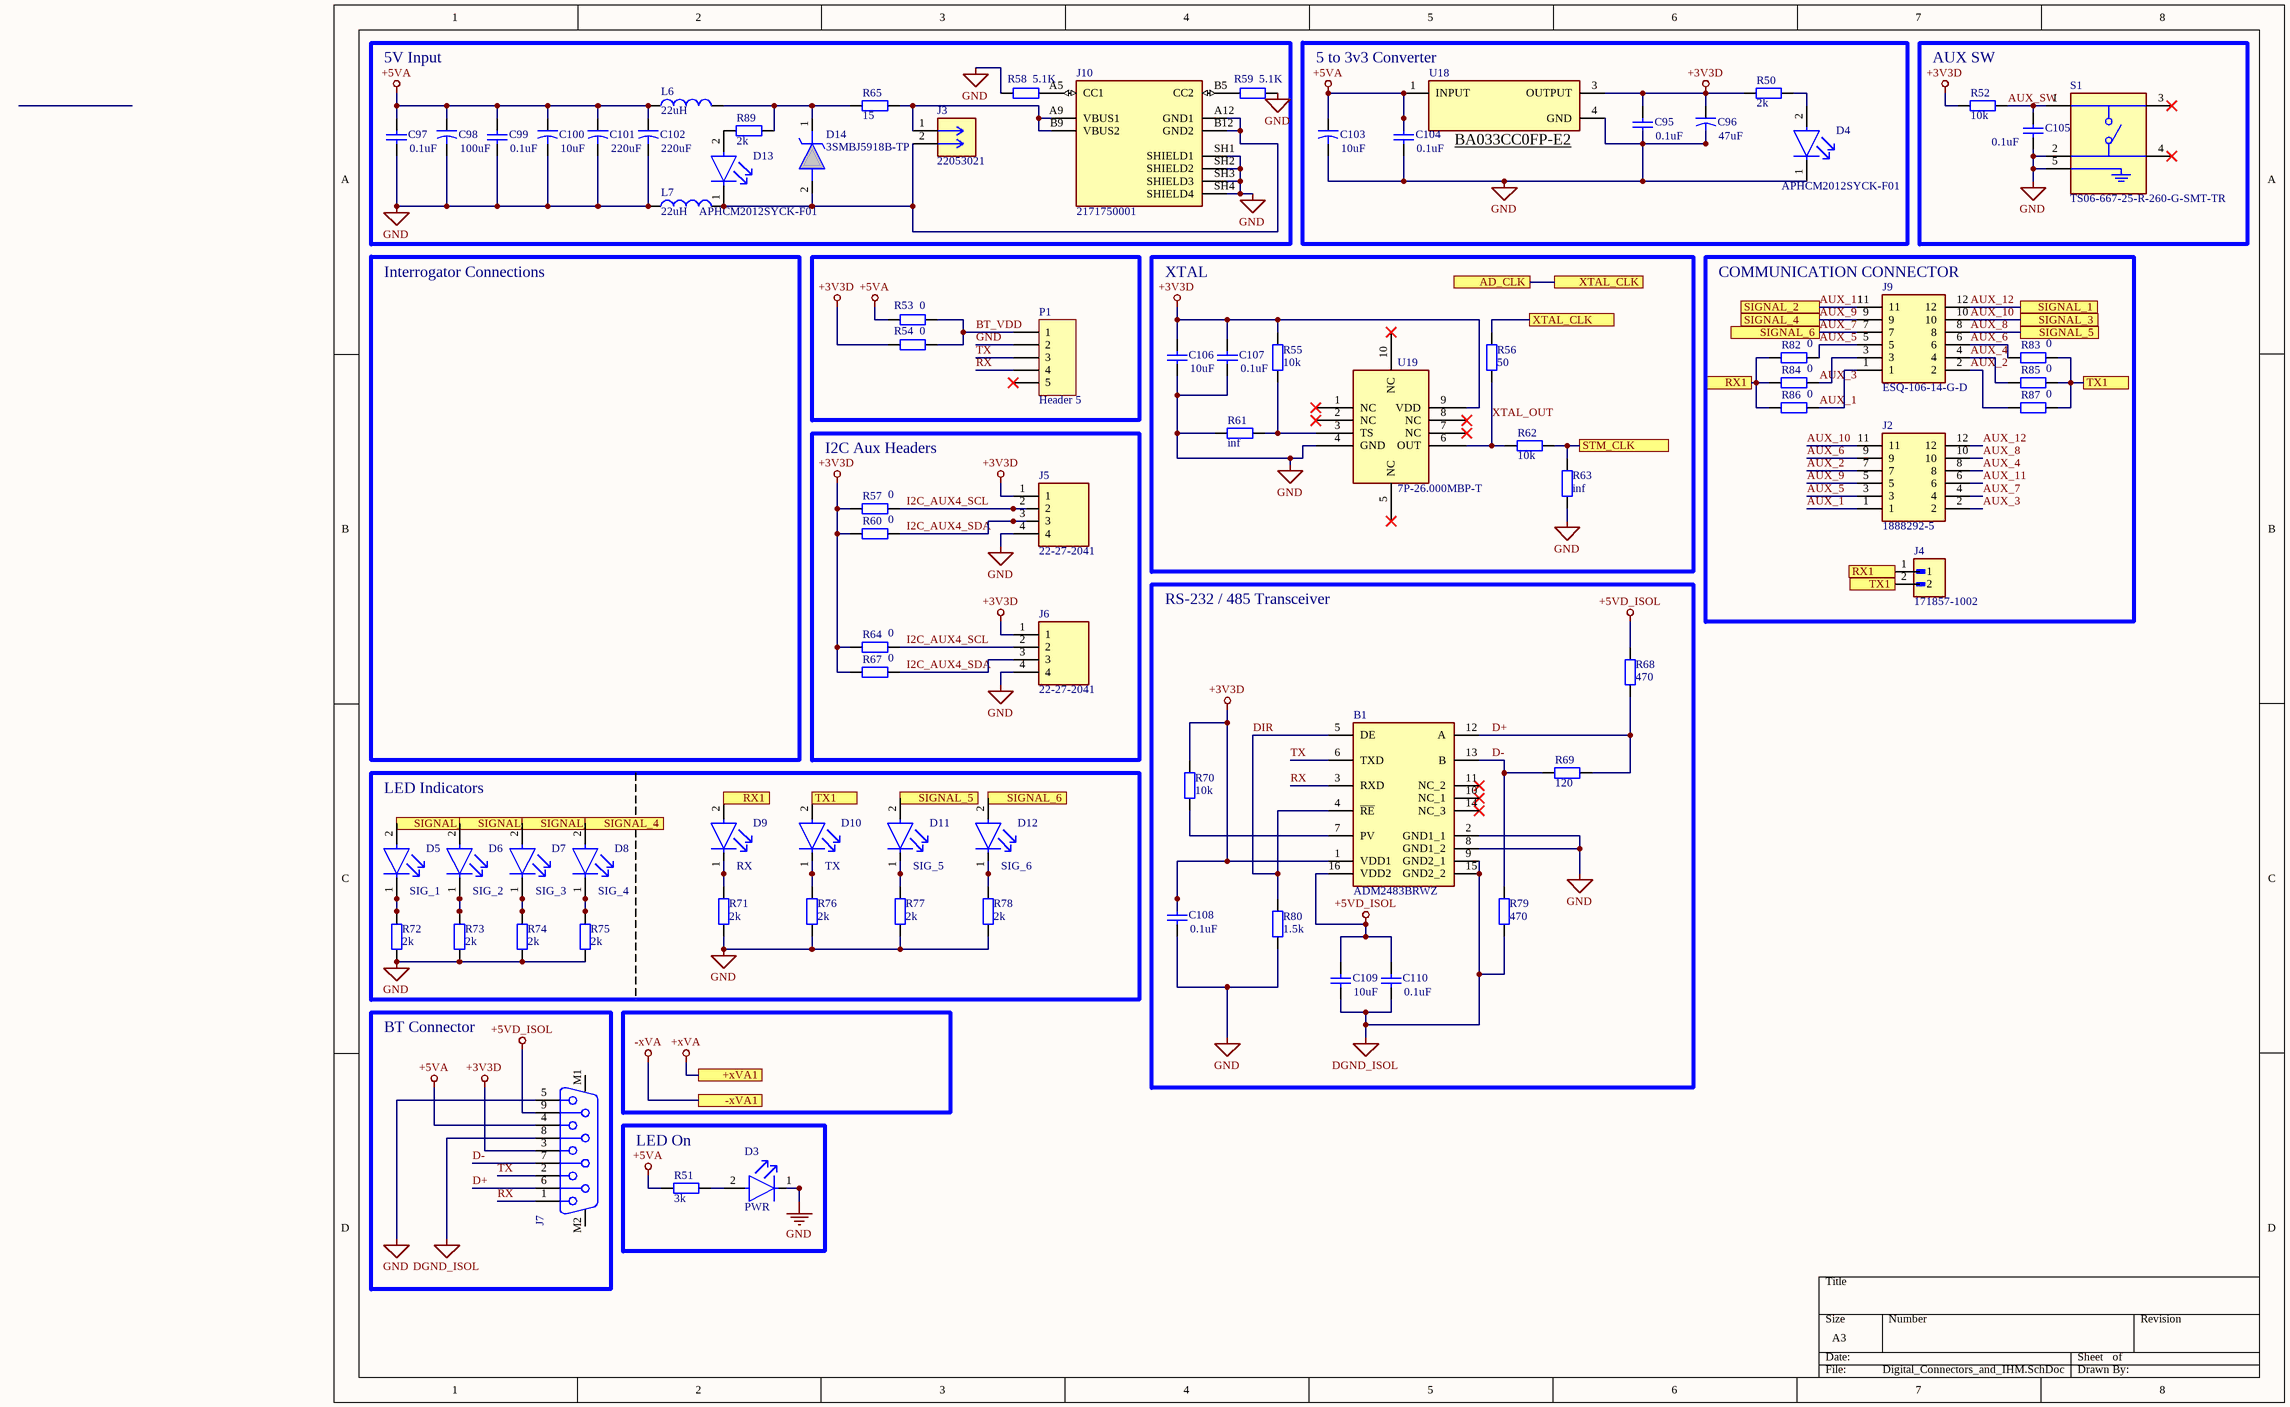
[diagram p2: Digital_Connectors_and_IHM.SchDoc]

### Parts
B1  ADM2483BRWZ  [ADM2483BRWZ]
C95  value 0.1uF  [CC_0805]  (hidden comment: Cap)
C96  value 47uF  [CC_0805]  (hidden comment: Cap2)
C97  value 0.1uF  [CC_0805]  (hidden comment: Cap)
C98  value 100uF  [CC_0805]  (hidden comment: Cap2)
C99  value 0.1uF  [CC_0805]  (hidden comment: Cap)
C100  value 10uF  [CC_0805]  (hidden comment: Cap2)
C101  value 220uF  [CC_0805]  (hidden comment: Cap2)
C102  value 220uF  [CC_0805]  (hidden comment: Cap2)
C103  value 10uF  [CC_0805]  (hidden comment: Cap2)
C104  value 0.1uF  [CC_0805]  (hidden comment: Cap)
C105  value 0.1uF  [CC_0805]  (hidden comment: Cap)
C106  value 10uF  [CC_0805]  (hidden comment: Cap)
C107  value 0.1uF  [CC_0805]  (hidden comment: Cap)
C108  value 0.1uF  [CC_0805]  (hidden comment: Cap)
C109  value 10uF  [CC_0805]  (hidden comment: Cap)
C110  value 0.1uF  [CC_0805]  (hidden comment: Cap)
D3  PWR  [FP-APHCM2012SYCK-F01-MFG]
D4  APHCM2012SYCK-F01  [FP-APHCM2012SYCK-F01-MFG]
D5  SIG_1  [FP-APHCM2012SYCK-F01-MFG]
D6  SIG_2  [FP-APHCM2012SYCK-F01-MFG]
D7  SIG_3  [FP-APHCM2012SYCK-F01-MFG]
D8  SIG_4  [FP-APHCM2012SYCK-F01-MFG]
D9  RX  [FP-APHCM2012SYCK-F01-MFG]
D10  TX  [FP-APHCM2012SYCK-F01-MFG]
D11  SIG_5  [FP-APHCM2012SYCK-F01-MFG]
D12  SIG_6  [FP-APHCM2012SYCK-F01-MFG]
D13  APHCM2012SYCK-F01  [FP-APHCM2012SYCK-F01-MFG]
D14  3SMBJ5918B-TP  [3SMBJ5918B-TP]
J2  1888292-5  [TE_1888292-5]
J3  22053021  [22-05-3021]
J4  171857-1002  [MOLEX_171857-1002]
J5  22-27-2041  [22-27-2041]
J6  22-27-2041  [22-27-2041]
J7  618009231121  [618009231121]  (value not drawn)
J9  ESQ-106-14-G-D  [ESQ-106-Y-X-D]
J10  2171750001  [MOLEX_2171750001]
L6  value 22uH  [WE-PMI_0805_H0.5]  (hidden comment: Inductor)
L7  value 22uH  [WE-PMI_0805_H0.5]  (hidden comment: Inductor)
P1  Header 5  [HDR1X5]
R50  value 2k  [RR_1220]  (hidden comment: Res2)
R51  value 3k  [RR_1220]  (hidden comment: Res2)
R52  value 10k  [RR_1220]  (hidden comment: Res2)
R53  value 0  [RR_1220]  (hidden comment: Res2)
R54  value 0  [RR_1220]  (hidden comment: Res2)
R55  value 10k  [RR_1220]  (hidden comment: Res2)
R56  value 50  [RR_1220]  (hidden comment: Res2)
R57  value 0  [RR_1220]  (hidden comment: Res2)
R58  value 5.1K  [RR_1220]  (hidden comment: Res2)
R59  value 5.1K  [RR_1220]  (hidden comment: Res2)
R60  value 0  [RR_1220]  (hidden comment: Res2)
R61  value inf  [RR_1220]  (hidden comment: Res2)
R62  value 10k  [RR_1220]  (hidden comment: Res2)
R63  value inf  [RR_1220]  (hidden comment: Res2)
R64  value 0  [RR_1220]  (hidden comment: Res2)
R65  value 15  [RR_1220]  (hidden comment: Res2)
R67  value 0  [RR_1220]  (hidden comment: Res2)
R68  value 470  [RR_1220]  (hidden comment: Res2)
R69  value 120  [RR_1220]  (hidden comment: Res2)
R70  value 10k  [RR_1220]  (hidden comment: Res2)
R71  value 2k  [RR_1220]  (hidden comment: Res2)
R72  value 2k  [RR_1220]  (hidden comment: Res2)
R73  value 2k  [RR_1220]  (hidden comment: Res2)
R74  value 2k  [RR_1220]  (hidden comment: Res2)
R75  value 2k  [RR_1220]  (hidden comment: Res2)
R76  value 2k  [RR_1220]  (hidden comment: Res2)
R77  value 2k  [RR_1220]  (hidden comment: Res2)
R78  value 2k  [RR_1220]  (hidden comment: Res2)
R79  value 470  [RR_1220]  (hidden comment: Res2)
R80  value 1.5k  [RR_1220]  (hidden comment: Res2)
R82  value 0  [RR_1220]  (hidden comment: Res2)
R83  value 0  [RR_1220]  (hidden comment: Res2)
R84  value 0  [RR_1220]  (hidden comment: Res2)
R85  value 0  [RR_1220]  (hidden comment: Res2)
R86  value 0  [RR_1220]  (hidden comment: Res2)
R87  value 0  [RR_1220]  (hidden comment: Res2)
R89  value 2k  [RR_1220]  (hidden comment: Res2)
S1  TS06-667-25-R-260-G-SMT-TR  [TS06-667-25-R-260-G-SMT-TR]
U18  TLV2217-33KVURG3  [FP-KVU0003A-MFG]  (value not drawn)
U19  7P-26.000MBP-T  [7P26000MBPT]

### Blocks framed on the sheet
5V Input: C97-C102 D13 D14 J3 J10 L6 L7 R58 R59 R65 R89
AUX SW: C105 R52 S1
XTAL: C106 C107 R55 R56 R61-R63 U19
COMMUNICATION CONNECTOR: J2 J4 J9 R82-R87
I2C Aux Headers: J5 J6 R57 R60 R64 R67
RS-232 / 485 Transceiver: B1 C108-C110 R68-R70 R79 R80
LED Indicators: D5-D12 R71-R78
BT Connector: J7
LED On: D3 R51

### Ports
+xVA1, -xVA1, AD_CLK (see Analog_Supply_and_TIA[5C], Digital_STMG474RE[3B]), RX1 (see Digital_Connectors_and_IHM[2C], Digital_Connectors_and_IHM[6B], Digital_STMG474RE[4B]), RX1 (see Digital_Connectors_and_IHM[2C], Digital_Connectors_and_IHM[7B], Digital_STMG474RE[4B]), RX1 (see Digital_Connectors_and_IHM[6B], Digital_Connectors_and_IHM[7B], Digital_STMG474RE[4B]), SIGNAL_1 (see Digital_Connectors_and_IHM[1C], Digital_STMG474RE[5B]), SIGNAL_1 (see Digital_Connectors_and_IHM[7A], Digital_STMG474RE[5B]), SIGNAL_2 (see Digital_Connectors_and_IHM[1C], Digital_STMG474RE[5B]), SIGNAL_2 (see Digital_Connectors_and_IHM[6A], Digital_STMG474RE[5B]), SIGNAL_3 (see Digital_Connectors_and_IHM[1C], Digital_STMG474RE[5B]), SIGNAL_3 (see Digital_Connectors_and_IHM[7A], Digital_STMG474RE[5B]), SIGNAL_4 (see Digital_Connectors_and_IHM[2C], Digital_STMG474RE[5B]), SIGNAL_4 (see Digital_Connectors_and_IHM[6A], Digital_STMG474RE[5B]), SIGNAL_5 (see Digital_Connectors_and_IHM[3C], Digital_STMG474RE[3A]), SIGNAL_5 (see Digital_Connectors_and_IHM[7A], Digital_STMG474RE[3A]), SIGNAL_6 (see Digital_Connectors_and_IHM[3C], Digital_STMG474RE[3A]), SIGNAL_6 (see Digital_Connectors_and_IHM[6A], Digital_STMG474RE[3A]), STM_CLK (see Digital_STMG474RE[5B]), TX1 (see Digital_Connectors_and_IHM[2C], Digital_Connectors_and_IHM[7B], Digital_STMG474RE[4A]), TX1 (see Digital_Connectors_and_IHM[2C], Digital_Connectors_and_IHM[8B], Digital_STMG474RE[4A]), TX1 (see Digital_Connectors_and_IHM[7B], Digital_Connectors_and_IHM[8B], Digital_STMG474RE[4A]), XTAL_CLK (see Digital_Connectors_and_IHM[5A]), XTAL_CLK (see Digital_Connectors_and_IHM[6A])

### Nets
+3V3D: B1.1(VDD1) C95.2 C96.1 C106.2 C107.2 C108.2 J5.1 J6.1 J7.3 R50.1 R52.1 R54.1 R55.2 R57.1 R60.1 R64.1 R67.1 R70.1 U18.3(OUTPUT) U19.9(VDD)  [project net VDD1]
+5VA: C97.2 C98.1 C99.2 C100.1 C101.1 C102.1 C103.1 C104.2 J7.4 L6.1 R51.2 R53.1 U18.1(INPUT)
+5VD_ISOL: B1.16(VDD2) C109.2 C110.2 J7.9 R68.1
+xVA: port +xVA1
-xVA: port -xVA1
DGND_ISOL: B1.9(GND2_1) B1.15(GND2_2) C109.1 C110.1 J7.8 R79.2
GND: B1.2(GND1_1) B1.8(GND1_2) C95.1 C96.2 C97.1 C98.2 C99.1 C100.2 C101.2 C102.2 C103.2 C104.1 C105.1 C106.1 C107.1 C108.1 D3.1(C) D4.1(C) J5.4 J6.4 J7.5 J10.SH1(SHIELD1) J10.SH2(SHIELD2) J10.SH3(SHIELD3) J10.SH4(SHIELD4) L7.1 P1.2 R58.1 R59.2 R61.1 R63.2 R71.2 R72.1 R73.1 R74.1 R75.1 R76.2 R77.1 R78.1 R80.2 S1.2 S1.5 U18.4(GND) U19.4(GND)
AUX_1: J2.1 J9.1 R86.2
AUX_2: J2.7 J9.2 R87.1
AUX_3: J2.2 J9.3 R84.2
AUX_4: J2.8 J9.4 R85.1
AUX_5: J2.3 J9.5 R82.2
AUX_6: J2.9 J9.6 R83.1
AUX_7: D12.2(A) J2.4 J9.7 ; port SIGNAL_6
AUX_8: D11.2(A) J2.10 J9.8 ; port SIGNAL_5
AUX_9: D8.2(A) J2.5 J9.9 ; port SIGNAL_4
AUX_10: D7.2(A) J2.11 J9.10 ; port SIGNAL_3
AUX_11: D6.2(A) J2.6 J9.11 ; port SIGNAL_2
AUX_12: D5.2(A) J2.12 J9.12 ; port SIGNAL_1
AUX_SW: C105.2 R52.2 S1.1
BT_VDD: P1.1 R53.2 R54.2
D+: B1.12(A) J7.6 R68.2 R69.1
D-: B1.13(B) J7.7 R69.2 R79.1
DIR: B1.4(~{RE}) B1.5(DE) R80.1
I2C_AUX4_SCL: J5.2 J6.2 R57.2 R64.2
I2C_AUX4_SDA: J5.3 J6.3 R60.2 R67.2
RX: B1.3(RXD) J7.1 P1.4
TX: B1.6(TXD) J7.2 P1.3
XTAL_OUT: R56.1 R62.2 U19.6(OUT)
NetB1_7: B1.7(PV) R70.2
NetD3_2: D3.2(A) R51.1
NetD4_2: D4.2(A) R50.2
NetD5_1: D5.1(C) R72.2
NetD6_1: D6.1(C) R73.2
NetD7_1: D7.1(C) R74.2
NetD8_1: D8.1(C) R75.2
NetD9_1: D9.1(C) R71.1
NetD9_2: D9.2(A) J4.1 R82.1 R84.1 R86.1 ; port RX1
NetD10_1: D10.1(C) R76.1
NetD10_2: D10.2(A) J4.2 R83.2 R85.2 R87.2 ; port TX1
NetD11_1: D11.1(C) R77.2
NetD12_1: D12.1(C) R78.2
NetD13_1: D13.1(C) D14.2(A) J3.2 J10.A12(GND1) J10.B12(GND2) L7.2
NetD13_2: D13.2(A) R89.2
NetD14_1: D14.1(K) L6.2 R65.2 R89.1
NetJ3_1: J3.1 J10.A9(VBUS1) J10.B9(VBUS2) R65.1
NetJ10_A5: J10.A5(CC1) R58.2
NetJ10_B5: J10.B5(CC2) R59.1
NetR55_1: R55.1 R61.2 U19.3(TS)
NetR56_2: R56.2 ; port XTAL_CLK, port AD_CLK
NetR62_1: R62.1 R63.1 ; port STM_CLK

Not connected (* = marked no-connect by the designer): B1 10(NC_1)* 11(NC_2)* 14(NC_3)*; J7 M1 M2; P1 5*; S1 3* 4*; U19 1(NC)* 2(NC)* 5(NC)* 7(NC)* 8(NC)* 10(NC)*

### Notes on the sheet
- (near U18) 5 to 3v3 Converter
- (near U18) BA033CC0FP-E2
- Interrogator Connections

### Library data of the parts
B1 = ADM2483BRWZ: Half-Duplex, iCoupler Isolated RS-485 Transceiver; Manufacturer_Name: Analog Devices; Geometry.Height: 2.65mm; Manufacturer_Part_Number: ADM2483BRWZ; Mouser Part Number: 584-ADM2483BRWZ; Mouser Price/Stock: https://www.mouser.co.uk/ProductDetail/Analog-Devices/ADM2483BRWZ?qs=BpaRKvA4VqH5Kim10agOlw%3D%3D; Arrow Part Number: ADM2483BRWZ; Arrow Price/Stock: https://www.arrow.com/en/products/adm2483brwz/analog-devices?utm_currency=USD&region=europe; Datasheet Link: http://uk.rs-online.com/web/p/products/0412719P
C95 C97 C99 C104-C110 = Cap: Capacitor; Published: 8-Jun-2000; LatestRevisionDate: 17-Jul-2002; LatestRevisionNote: Re-released for DXP Platform.; PackageReference: RAD-0.3; Publisher: Altium Limited; PackageDescription: Radial Cap, Thru-Hole; 2 Leads; 0.3 in Pin Spacing
C96 C98 C100-C103 = Cap2: Capacitor; Published: 23-Sep-2002; PackageReference: CAPR5-4X5; Publisher: Altium Limited; PackageDescription: Capacitor; 2 Leads
D3-D13 = CMP-44529-000064-1: LED YELLOW CLEAR CHIP SMD; Number of LEDs: 1; Luminous Intensity: 150mcd; Dominant Wavelength: 590nm; Test Current: 20mA; Illumination Color: Green; Forward Voltage: 2V; Viewing Angle: 110°; Number of Pins: 2; Packaging: Tape and Reel; Width: 1.25mm; Height: 0.4mm; Lens Color: Clear; RoHS Compliant: Yes; Lead Free: Lead Free; Min Operating Temperature: -40°C; Case Code (Imperial): 0805; Case/Package: 0805; Series: APHCM; Wavelength: 590nm; Max Operating Temperature: 85°C; Length: 2mm; Color: Yellow; Package Quantity: 2000; Mount: Surface Mount; Lens Style: Clear; Forward Current: 20mA; Case Code (Metric): 2012
D14 = 3SMBJ5918B-TP: Zener Diodes; Manufacturer_Name: MCC; Geometry.Height: 2.62mm; Manufacturer_Part_Number: 3SMBJ5918B-TP; Mouser Part Number: 833-3SMBJ5918B-TP; Mouser Price/Stock: https://www.mouser.com/Search/Refine.aspx?Keyword=833-3SMBJ5918B-TP; Arrow Part Number: 3SMBJ5918B-TP; Arrow Price/Stock: https://www.arrow.com/en/products/3smbj5918b-tp/micro-commercial-components; Datasheet Link: https://www.mccsemi.com/pdf/Products/3SMBJ5918B-3SMBJ5956B(SMB).pdf
J2 = 1888292-5: 12 Position, Elevated Socket Strip, 0.100&quot; Pitch; Manufacturer_Name: SAMTEC; Manufacturer_Part_Number: ESQ-106-14-G-D; Mouser Part Number: 200-ESQ10614GD; Mouser Price/Stock: https://www.mouser.co.uk/ProductDetail/Samtec/ESQ-106-14-G-D?qs=0lQeLiL1qybkPQShhYifng%3D%3D; Arrow Part Number: *; Arrow Price/Stock: *; Datasheet Link: http://suddendocs.samtec.com/prints/esq-1xx-xx-x-x-xxx-xx-x-xx-mkt.pdf
J4 = 171857-1002: MF: {'manufacturer': u'Molex'}; Package: None; Price: None; Value: *; MP: 171857-1002; Availability: Unavailable
J5 J6 = 22-27-2041: Headers & Wire Housings 4 POS HEADER; Manufacturer_Name: Molex; Geometry.Height: 11.7mm; Manufacturer_Part_Number: 22-27-2041; Mouser Part Number: 538-22-27-2041; Mouser Price/Stock: https://www.mouser.co.uk/ProductDetail/Molex/22-27-2041?qs=hSmm4fxMIuMKVUQkn4wbYQ%3D%3D; Arrow Part Number: *; Arrow Price/Stock: *; Datasheet Link: https://www.molex.com/pdm_docs/sd/022272041_sd.pdf
J7 = 618009231121: WR-DSUB 8.08mm Female PCB Connector with Hex Screw, THT, Angled, 9p; Manufacturer: Wurth Elektronik; Contact Resistance: 30mΩ; Rated Current: 3A; Working Voltage: 125VAC; Withstanding Voltage: 1000VAC; Manufacturer Part Number: 618009231121; Category: Input/Output Connector; Match Code: WR-DSUB; ComponentLink1Description: Website Link; ComponentLink1URL: https://www.we-online.com/redexpert/article/618009231121?ad; ComponentLink2Description: Datasheet Link; ComponentLink2URL: https://www.we-online.com/redexpert/spec/618009231121?ad; Mount: Through Hole; Min Operating Temperature: -55°C; Max Operating Temperature: 105°C; Packaging: Tray; Gender: Female; Number of Pins: 9; Orientation: Angled
J9 = ESQ-106-14-G-D: 12 Position, Elevated Socket Strip, 0.100&quot; Pitch; Manufacturer_Name: SAMTEC; Manufacturer_Part_Number: ESQ-106-14-G-D; Mouser Part Number: 200-ESQ10614GD; Mouser Price/Stock: https://www.mouser.co.uk/ProductDetail/Samtec/ESQ-106-14-G-D?qs=0lQeLiL1qybkPQShhYifng%3D%3D; Arrow Part Number: *; Arrow Price/Stock: *; Datasheet Link: http://suddendocs.samtec.com/prints/esq-1xx-xx-x-x-xxx-xx-x-xx-mkt.pdf
J10 = 2171750001: USB-C (USB TYPE-C) USB 2.0 Receptacle Connector 24 (6+18 Dummy) Position Surface Mount, Right Angle; Through Hole; MF: Molex; SnapEDA_Link: https://www.snapeda.com/parts/2171750001/Molex/view-part/?ref=snap; Package: None; Value: *; MP: 2171750001; Check_prices: https://www.snapeda.com/parts/2171750001/Molex/view-part/?ref=eda
L6 L7 = Inductor: Code_IEC: 1005; Published: 8-Jun-2000; LatestRevisionDate: 29-May-2009; LatestRevisionNote: IPC-7351 Footprint Added.; PackageReference: 0402-A; Publisher: Altium Limited; PackageDescription: Chip Inductor; Code_JEITA: 0402
P1 = Header 5: Header, 5-Pin; LatestRevisionDate: 17-Jul-2002; LatestRevisionNote: Re-released for DXP Platform.; Publisher: Altium Limited
R50-R65 R67-R80 R82-R87 R89 = Res2: Resistor; Published: 8-Jun-2000; LatestRevisionDate: 17-Jul-2002; LatestRevisionNote: Re-released for DXP Platform.; PackageReference: AXIAL-0.4; Publisher: Altium Limited; PackageDescription: Axial Device, Thru-Hole; 2 Leads; 0.4 in Pin Spacing
S1 = TS06-667-25-R-260-G-SMT-TR: 6 x 6.7 mm, 2.5 mm Actuator Height, 260 gf, Red, Surface Mount, SPST, Tactile Switch; MF: Same Sky; SnapEDA_Link: https://www.snapeda.com/parts/TS06-667-25-R-260-G-SMT-TR/Same+Sky/view-part/?ref=snap; Package: None; Value: *; MP: TS06-667-25-R-260-G-SMT-TR; Check_prices: https://www.snapeda.com/parts/TS06-667-25-R-260-G-SMT-TR/Same+Sky/view-part/?ref=eda
U18 = CMP-04917-000319-1: IC REG LINEAR 3.3V 500MA TO252-3; Number of Outputs: 1; Max Input Voltage: 12V; Min Input Voltage: 3V; Polarity: Positive; Dropout Voltage: 500mV; Output Type: Fixed; Output Voltage Accuracy: 1%; Quiescent Current: 290uA; Case/Package: TO-252; Radiation Hardening: No; Min Operating Temperature: 0°C; Output Current: 500mA; Package Quantity: 1; Packaging: Cut Tape; Mount: Surface Mount; Lead Free: Lead Free; RoHS Compliant: Yes; Contact Plating: Tin; Series: -; Nominal Output Voltage: 3.3V; Number of Pins: 3; REACH SVHC: No SVHC; Max Operating Temperature: 125°C; Number of Regulators: 1; Output Voltage: 3.3V; Input Bias Current: 290uA; Accuracy: 1%; Max Output Current: 500mA
J3 = 22053021: Package: None; Price: None; Value: *; MP: 22053021; Availability: Unavailable

## Sheet Digital_STMG474RE.SchDoc
size A3; SheetNumber: 4; SheetTotal: 4
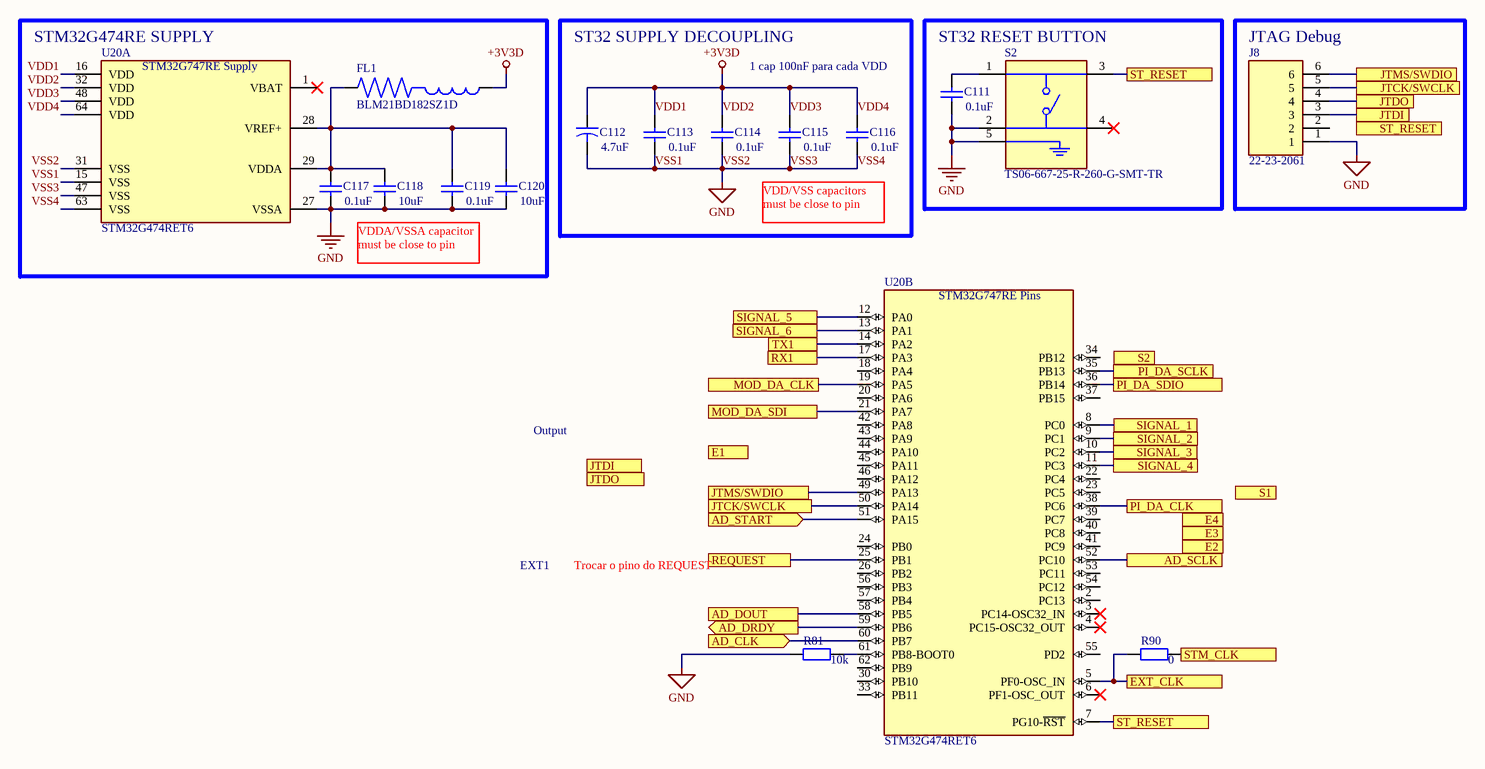
[diagram p3: Digital_STMG474RE.SchDoc]

### Parts
C111  value 0.1uF  [CC_0805]  (hidden comment: Cap)
C112  value 4.7uF  [CC_0805]  (hidden comment: Cap2)
C113  value 0.1uF  [CC_0805]  (hidden comment: Cap)
C114  value 0.1uF  [CC_0805]  (hidden comment: Cap)
C115  value 0.1uF  [CC_0805]  (hidden comment: Cap)
C116  value 0.1uF  [CC_0805]  (hidden comment: Cap)
C117  value 0.1uF  [CC_0805]  (hidden comment: Cap)
C118  value 10uF  [CC_0805]  (hidden comment: Cap)
C119  value 0.1uF  [CC_0805]  (hidden comment: Cap)
C120  value 10uF  [CC_0805]  (hidden comment: Cap)
FL1  BLM21BD182SZ1D  [BLM21BD182SZ1D]
J8  22-23-2061  [22-23-2061]
R81  value 10k  [RR_1220]  (hidden comment: Res2)
R90  value 0  [RR_1220]  (hidden comment: Res2)
S2  TS06-667-25-R-260-G-SMT-TR  [TS06-667-25-R-260-G-SMT-TR]
U20  STM32G474RET6  [STMG474RET6]  (parts A,B of 2)

### Blocks framed on the sheet
STM32G474RE SUPPLY: C117-C120 FL1 U20
ST32 SUPPLY DECOUPLING: C112-C116
ST32 RESET BUTTON: C111 S2
JTAG Debug: J8

### Ports
AD_CLK (in, see Analog_Supply_and_TIA[5C], Digital_Connectors_and_IHM[2A], Digital_Connectors_and_IHM[5A]), AD_DOUT (see Analog_Supply_and_TIA[4C], Digital_Connectors_and_IHM[1A]), AD_DRDY (out, see Analog_Supply_and_TIA[4C], Digital_Connectors_and_IHM[1A]), AD_SCLK (see Analog_Supply_and_TIA[5C], Digital_Connectors_and_IHM[1A]), AD_START (in, see Analog_Supply_and_TIA[3C], Digital_Connectors_and_IHM[1A]), E1, E2, E3, E4, EXT_CLK, JTCK/SWCLK (see Digital_STMG474RE[3B]), JTCK/SWCLK (see Digital_STMG474RE[6A]), JTDI (see Digital_STMG474RE[3B]), JTDI (see Digital_STMG474RE[6A]), JTDO (see Digital_STMG474RE[3B]), JTDO (see Digital_STMG474RE[6A]), JTMS/SWDIO (see Digital_STMG474RE[3B]), JTMS/SWDIO (see Digital_STMG474RE[6A]), MOD_DA_CLK (see Analog_Modulation[5A], Digital_Connectors_and_IHM[1B]), MOD_DA_SDI (see Analog_Modulation[5A], Digital_Connectors_and_IHM[1B]), PI_DA_CLK (see Analog_Modulation[1A], Digital_Connectors_and_IHM[1B]), PI_DA_SCLK (see Analog_Modulation[1A], Digital_Connectors_and_IHM[2B]), PI_DA_SDIO (see Analog_Modulation[1A], Digital_Connectors_and_IHM[2B]), REQUEST, RX1 (see Digital_Connectors_and_IHM[6B]), S1, S2, SIGNAL_1 (see Digital_Connectors_and_IHM[1C], Digital_Connectors_and_IHM[7A]), SIGNAL_2 (see Digital_Connectors_and_IHM[1C], Digital_Connectors_and_IHM[6A]), SIGNAL_3 (see Digital_Connectors_and_IHM[1C], Digital_Connectors_and_IHM[7A]), SIGNAL_4 (see Digital_Connectors_and_IHM[2C], Digital_Connectors_and_IHM[6A]), SIGNAL_5 (see Digital_Connectors_and_IHM[3C], Digital_Connectors_and_IHM[7A]), SIGNAL_6 (see Digital_Connectors_and_IHM[4C], Digital_Connectors_and_IHM[6A]), ST_RESET (see Digital_STMG474RE[5A], Digital_STMG474RE[5B]), ST_RESET (see Digital_STMG474RE[5A], Digital_STMG474RE[6A]), ST_RESET (see Digital_STMG474RE[5B], Digital_STMG474RE[6A]), STM_CLK (see Digital_Connectors_and_IHM[6B]), TX1 (see Digital_Connectors_and_IHM[8B])

### Nets
GND: C111.1 C112.2 C113.1 C114.1 C115.1 C116.1 C117.1 C118.1 C119.1 C120.1 J8.1 R81.1 S2.2 S2.5 U20.15(VSS) U20.27(VSSA) U20.31(VSS) U20.47(VSS) U20.63(VSS)  [also labelled VSS1, VSS2, VSS3, VSS4]
VDD1: C112.1 C113.2 C114.2 C115.2 C116.2 FL1.1 U20.16(VDD) U20.32(VDD) U20.48(VDD) U20.64(VDD)  [also labelled +3V3D, VDD2, VDD3, VDD4]
AUX_7: U20.13(PA1) ; port SIGNAL_6
AUX_8: U20.12(PA0) ; port SIGNAL_5
AUX_9: U20.11(PC3) ; port SIGNAL_4
AUX_10: U20.10(PC2) ; port SIGNAL_3
AUX_11: U20.9(PC1) ; port SIGNAL_2
AUX_12: U20.8(PC0) ; port SIGNAL_1
NetC52_1: U20.38(PC6) ; port PI_DA_CLK
NetC111_2: C111.2 S2.1
NetC117_2: C117.2 C118.2 C119.2 C120.2 FL1.2 U20.28(VREF+) U20.29(VDDA)
NetD9_2: U20.17(PA3) ; port RX1
NetD10_2: U20.14(PA2) ; port TX1
NetJ8_3: J8.3 ; port JTDI
NetJ8_4: J8.4 ; port JTDO
NetJ8_5: J8.5 U20.50(PA14) ; port JTCK/SWCLK
NetJ8_6: J8.6 U20.49(PA13) ; port JTMS/SWDIO
NetR17_1: U20.52(PC10) ; port AD_SCLK
NetR18_2: U20.58(PB5) ; port AD_DOUT
NetR19_1: U20.51(PA15) ; port AD_START
NetR23_2: U20.59(PB6) ; port AD_DRDY
NetR24_2: U20.36(PB14) ; port PI_DA_SDIO
NetR25_2: U20.35(PB13) ; port PI_DA_SCLK
NetR28_1: U20.21(PA7) ; port MOD_DA_SDI
NetR29_1: U20.19(PA5) ; port MOD_DA_CLK
NetR56_2: U20.60(PB7) ; port AD_CLK
NetR62_1: R90.2 ; port STM_CLK
NetR81_2: R81.2 U20.61(PB8-BOOT0)
NetR90_1: R90.1 U20.5(PF0-OSC_IN) ; port EXT_CLK
NetS2_3: S2.3 U20.7(PG10-~{RST}) ; port ST_RESET
NetU20_25: U20.25(PB1) ; port REQUEST

Not connected (* = marked no-connect by the designer): J8 2; S2 4*; U20 1(VBAT)* 2(PC13) 3(PC14-OSC32_IN)* 4(PC15-OSC32_OUT)* 6(PF1-OSC_OUT)* 18(PA4) 20(PA6) 22(PC4) 23(PC5) 24(PB0) 26(PB2) 30(PB10) 33(PB11) 34(PB12) 37(PB15) 39(PC7) 40(PC8) 41(PC9) 42(PA8) 43(PA9) 44(PA10) 45(PA11) 46(PA12) 53(PC11) 54(PC12) 55(PD2) 56(PB3) 57(PB4) 62(PB9)

### Notes on the sheet
- 1 cap 100nF para cada VDD
- VDD/VSS capacitors must be close to pin
- VDDA/VSSA capacitor must be close to pin
- Output
- EXT1
- Trocar o pino do REQUEST
- (in symbol STM32G474RET6, part A) STM32G747RE Supply
- (in symbol STM32G474RET6, part B) STM32G747RE Pins

### Library data of the parts
C111 C113-C120 = Cap: Capacitor; Published: 8-Jun-2000; LatestRevisionDate: 17-Jul-2002; LatestRevisionNote: Re-released for DXP Platform.; PackageReference: RAD-0.3; Publisher: Altium Limited; PackageDescription: Radial Cap, Thru-Hole; 2 Leads; 0.3 in Pin Spacing
C112 = Cap2: Capacitor; Published: 23-Sep-2002; PackageReference: CAPR5-4X5; Publisher: Altium Limited; PackageDescription: Capacitor; 2 Leads
J8 = 22-23-2061: 2.54mm,header,KK,vert,Sn,frictn lock,6w Molex KK 254 Series, Series Number 6373, 2.54mm Pitch 6 Way 1 Row Straight PCB Header, Through Hole, Solder Termination; Geometry.Height: 11.05mm; Manufacturer_Name: Molex; Manufacturer_Part_Number: 22-23-2061; Mouser Part Number: 538-22-23-2061; Mouser Price/Stock: https://www.mouser.co.uk/ProductDetail/Molex/22-23-2061?qs=ILqg114nvd6YkpLBwrcQsQ%3D%3D; Arrow Part Number: *; Arrow Price/Stock: *; Datasheet Link: http://www.molex.com/pdm_docs/sd/022232061_sd.pdf
R81 R90 = Res2: Resistor; Published: 8-Jun-2000; LatestRevisionDate: 17-Jul-2002; LatestRevisionNote: Re-released for DXP Platform.; PackageReference: AXIAL-0.4; Publisher: Altium Limited; PackageDescription: Axial Device, Thru-Hole; 2 Leads; 0.4 in Pin Spacing
S2 = TS06-667-25-R-260-G-SMT-TR: as S1 on sheet Digital_Connectors_and_IHM; SnapEDA_Link: https://www.snapeda.com/parts/TS06-667-25-R-260-G-SMT-TR/Same+Sky/view-part/?ref=snap; Package: None; Value: *; MP: TS06-667-25-R-260-G-SMT-TR; Check_prices: https://www.snapeda.com/parts/TS06-667-25-R-260-G-SMT-TR/Same+Sky/view-part/?ref=eda
U20 = STM32G474RET6: ARMÂ® CortexÂ®-M4F STM32G4 Microcontroller IC 32-Bit Single-Core 170MHz 512KB (512K x 8) FLASH 64-LQFP (10x10); MF: STMicroelectronics; SnapEDA_Link: https://www.snapeda.com/parts/STM32G474RET6/STMicroelectronics/view-part/?ref=snap; Package: LQFP-64 STMicroelectronics; Value: *; MP: STM32G474RET6; Check_prices: https://www.snapeda.com/parts/STM32G474RET6/STMicroelectronics/view-part/?ref=eda
FL1 = BLM21BD182SZ1D: Package: None; Price: None; Value: *; MP: BLM21BD182SZ1D; Availability: Unavailable

## Nets that join several sheets
+5VA: Analog_Supply_and_TIA (33 pins), Analog_Modulation (17 pins), Digital_Connectors_and_IHM (13 pins)
GND: Analog_Supply_and_TIA (86 pins), Analog_Modulation (50 pins), Digital_Connectors_and_IHM (44 pins), Digital_STMG474RE (19 pins)
VDD1: Digital_Connectors_and_IHM (20 pins), Digital_STMG474RE (10 pins)
AUX_7: Digital_Connectors_and_IHM (D12.2 J2.4 J9.7), Digital_STMG474RE (U20.13)
AUX_8: Digital_Connectors_and_IHM (D11.2 J2.10 J9.8), Digital_STMG474RE (U20.12)
AUX_9: Digital_Connectors_and_IHM (D8.2 J2.5 J9.9), Digital_STMG474RE (U20.11)
AUX_10: Digital_Connectors_and_IHM (D7.2 J2.11 J9.10), Digital_STMG474RE (U20.10)
AUX_11: Digital_Connectors_and_IHM (D6.2 J2.6 J9.11), Digital_STMG474RE (U20.9)
AUX_12: Digital_Connectors_and_IHM (D5.2 J2.12 J9.12), Digital_STMG474RE (U20.8)
NetC52_1: Analog_Modulation (C52.1 R27.2), Digital_STMG474RE (U20.38)
NetD9_2: Digital_Connectors_and_IHM (5 pins), Digital_STMG474RE (U20.17)
NetD10_2: Digital_Connectors_and_IHM (5 pins), Digital_STMG474RE (U20.14)
NetR17_1: Analog_Supply_and_TIA (R17.1), Digital_STMG474RE (U20.52)
NetR18_2: Analog_Supply_and_TIA (R18.2), Digital_STMG474RE (U20.58)
NetR19_1: Analog_Supply_and_TIA (R19.1), Digital_STMG474RE (U20.51)
NetR23_2: Analog_Supply_and_TIA (R23.2), Digital_STMG474RE (U20.59)
NetR24_2: Analog_Modulation (R24.2), Digital_STMG474RE (U20.36)
NetR25_2: Analog_Modulation (R25.2), Digital_STMG474RE (U20.35)
NetR28_1: Analog_Modulation (R28.1), Digital_STMG474RE (U20.21)
NetR29_1: Analog_Modulation (R29.1), Digital_STMG474RE (U20.19)
NetR56_2: Analog_Supply_and_TIA (R88.1), Digital_Connectors_and_IHM (R56.2), Digital_STMG474RE (U20.60)
NetR62_1: Digital_Connectors_and_IHM (R62.1 R63.1), Digital_STMG474RE (R90.2)